# Altium project edison_breakout.PrjPcb (part 1 of 2)
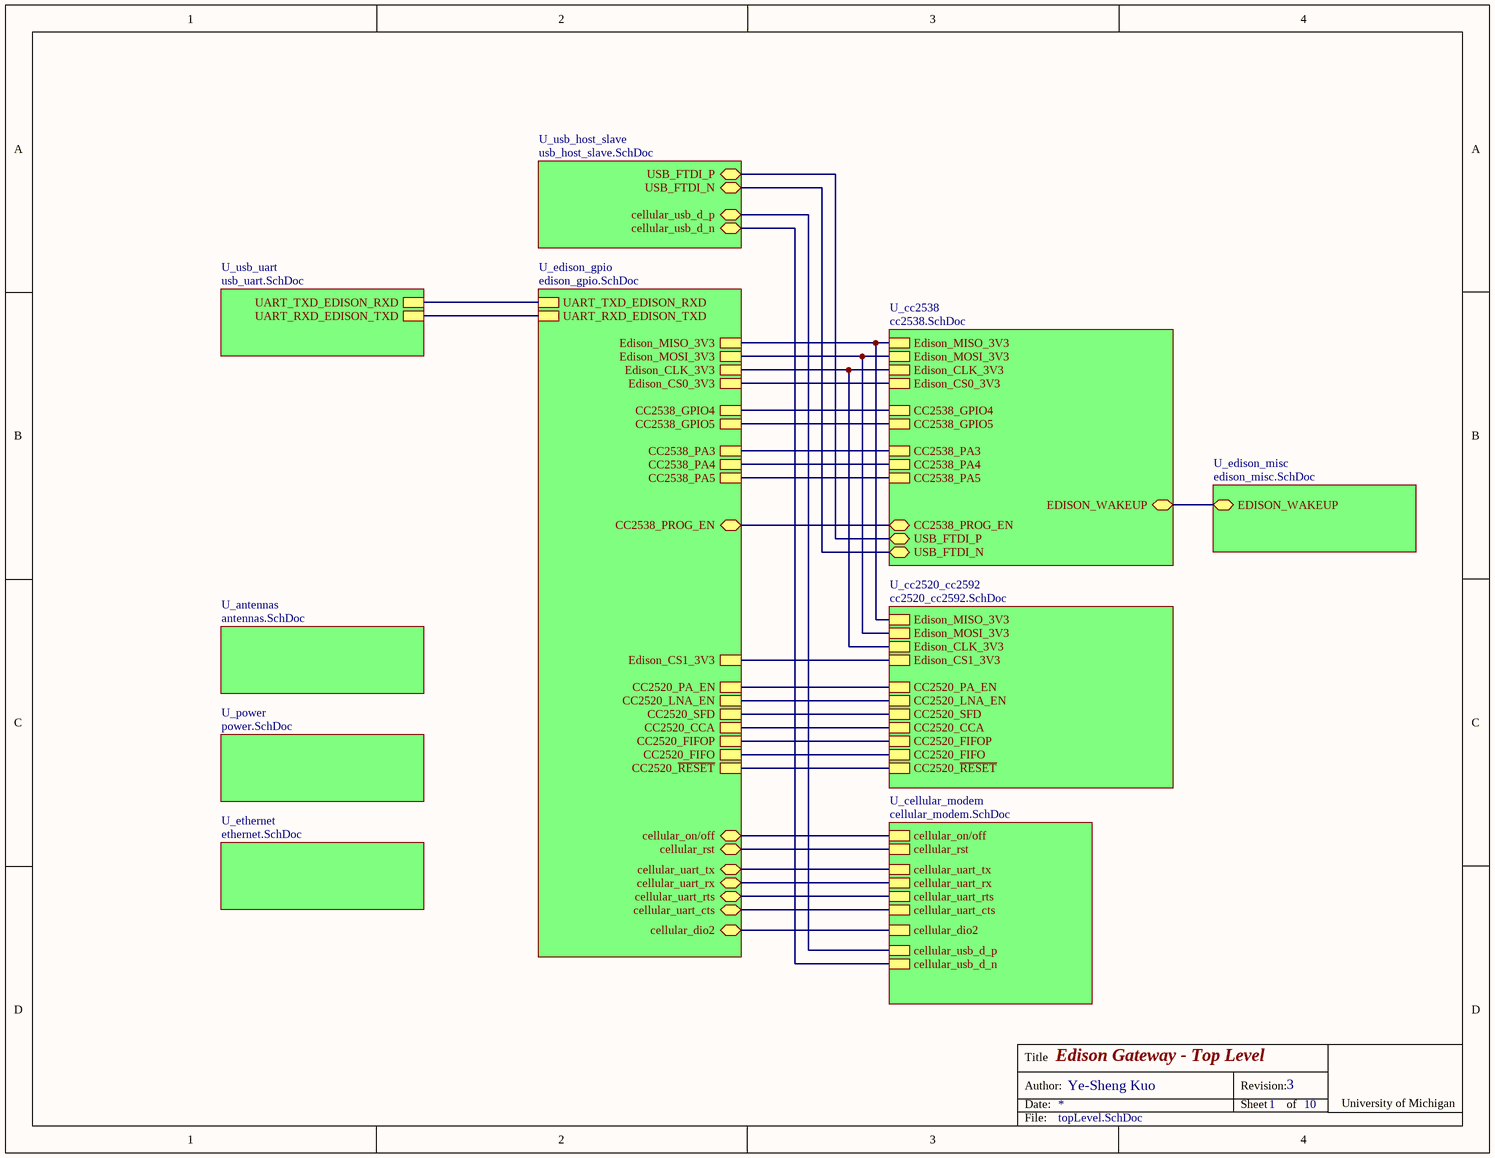
[diagram p0: topLevel.SchDoc]
11 sheets, 252 parts. Net scope: hierarchical (ports join the sheet entries above them; power ports are global).
Board files: edison_gateway_v3.PcbDoc, edison_gateway_v3_array.PcbDoc, edison_gateway_v3_array_stencil.PcbDoc
Sheets:
  topLevel.SchDoc
    U_cc2538 = cc2538.SchDoc
    U_edison_gpio = edison_gpio.SchDoc
    U_edison_misc = edison_misc.SchDoc
    U_ethernet = ethernet.SchDoc
    U_power = power.SchDoc
    U_usb_host_slave = usb_host_slave.SchDoc
    U_usb_uart = usb_uart.SchDoc
    U_cc2520_cc2592 = cc2520_cc2592.SchDoc
    U_cellular_modem = cellular_modem.SchDoc
    U_antennas = antennas.SchDoc

## Sheet topLevel.SchDoc: Edison Gateway - Top Level
size Letter; Author: Ye-Sheng Kuo; DocumentNumber: 1; Revision: 3; SheetNumber: 1; SheetTotal: 10

### Sub-sheets
U_antennas = antennas.SchDoc: no entries
U_cc2520_cc2592 = cc2520_cc2592.SchDoc: CC2520_PA_EN, CC2520_LNA_EN, CC2520_SFD, CC2520_CCA, CC2520_FIFOP, CC2520_FIFO, CC2520_~{RESET}, Edison_MISO_3V3, Edison_MOSI_3V3, Edison_CLK_3V3, Edison_CS1_3V3
U_cc2538 = cc2538.SchDoc: CC2538_PA3, CC2538_PA4, CC2538_PA5, Edison_MISO_3V3, Edison_MOSI_3V3, Edison_CLK_3V3, Edison_CS0_3V3, CC2538_GPIO4, CC2538_GPIO5, EDISON_WAKEUP, CC2538_PROG_EN, USB_FTDI_P, USB_FTDI_N
U_cellular_modem = cellular_modem.SchDoc: cellular_on/off, cellular_rst, cellular_usb_d_p, cellular_usb_d_n, cellular_uart_tx, cellular_uart_rx, cellular_uart_rts, cellular_uart_cts, cellular_dio2
U_edison_gpio = edison_gpio.SchDoc: UART_TXD_EDISON_RXD, UART_RXD_EDISON_TXD, Edison_MISO_3V3, Edison_MOSI_3V3, Edison_CLK_3V3, Edison_CS0_3V3, CC2538_GPIO4, CC2538_GPIO5, CC2538_PA3, CC2538_PA4, CC2538_PA5, Edison_CS1_3V3, CC2520_PA_EN, CC2520_LNA_EN, CC2520_SFD, CC2520_CCA, CC2520_FIFOP, CC2520_FIFO, CC2520_~{RESET}, CC2538_PROG_EN, cellular_on/off, cellular_uart_tx, cellular_uart_rx, cellular_uart_rts, cellular_rst, cellular_uart_cts, cellular_dio2
U_edison_misc = edison_misc.SchDoc: EDISON_WAKEUP
U_ethernet = ethernet.SchDoc: no entries
U_power = power.SchDoc: no entries
U_usb_host_slave = usb_host_slave.SchDoc: USB_FTDI_N, USB_FTDI_P, cellular_usb_d_p, cellular_usb_d_n
U_usb_uart = usb_uart.SchDoc: UART_TXD_EDISON_RXD, UART_RXD_EDISON_TXD

### Nets
CC2538_PA3: sheet U_cc2538/CC2538_PA3, sheet U_edison_gpio/CC2538_PA3
CC2538_PA4: sheet U_cc2538/CC2538_PA4, sheet U_edison_gpio/CC2538_PA4
CC2538_PA5: sheet U_cc2538/CC2538_PA5, sheet U_edison_gpio/CC2538_PA5
cellular_dio2: sheet U_edison_gpio/cellular_dio2, sheet U_cellular_modem/cellular_dio2
cellular_on/off: sheet U_edison_gpio/cellular_on/off, sheet U_cellular_modem/cellular_on/off
cellular_rst: sheet U_edison_gpio/cellular_rst, sheet U_cellular_modem/cellular_rst
cellular_usb_d_n: sheet U_usb_host_slave/cellular_usb_d_n, sheet U_cellular_modem/cellular_usb_d_n
cellular_usb_d_p: sheet U_usb_host_slave/cellular_usb_d_p, sheet U_cellular_modem/cellular_usb_d_p
Edison_CLK_3V3: sheet U_cc2538/Edison_CLK_3V3, sheet U_edison_gpio/Edison_CLK_3V3, sheet U_cc2520_cc2592/Edison_CLK_3V3
Edison_CS0_3V3: sheet U_cc2538/Edison_CS0_3V3, sheet U_edison_gpio/Edison_CS0_3V3
Edison_CS1_3V3: sheet U_edison_gpio/Edison_CS1_3V3, sheet U_cc2520_cc2592/Edison_CS1_3V3
Edison_GP14_3V3: sheet U_edison_gpio/CC2520_FIFOP, sheet U_cc2520_cc2592/CC2520_FIFOP
Edison_GP19_3V3: sheet U_edison_gpio/CC2520_~{RESET}, sheet U_cc2520_cc2592/CC2520_~{RESET}
Edison_GP20_3V3: sheet U_edison_gpio/CC2520_FIFO, sheet U_cc2520_cc2592/CC2520_FIFO
Edison_GP41_3V3: sheet U_cc2538/CC2538_GPIO5, sheet U_edison_gpio/CC2538_GPIO5
Edison_GP43_3V3: sheet U_cc2538/CC2538_GPIO4, sheet U_edison_gpio/CC2538_GPIO4
Edison_GP45: sheet U_cc2538/CC2538_PROG_EN, sheet U_edison_gpio/CC2538_PROG_EN
Edison_GP47_3V3: sheet U_edison_gpio/CC2520_LNA_EN, sheet U_cc2520_cc2592/CC2520_LNA_EN
Edison_GP48_3V3: sheet U_edison_gpio/CC2520_SFD, sheet U_cc2520_cc2592/CC2520_SFD
Edison_GP49_3V3: sheet U_edison_gpio/CC2520_CCA, sheet U_cc2520_cc2592/CC2520_CCA
Edison_GP183_3V3: sheet U_edison_gpio/CC2520_PA_EN, sheet U_cc2520_cc2592/CC2520_PA_EN
Edison_MISO_3V3: sheet U_cc2538/Edison_MISO_3V3, sheet U_edison_gpio/Edison_MISO_3V3, sheet U_cc2520_cc2592/Edison_MISO_3V3
Edison_MOSI_3V3: sheet U_cc2538/Edison_MOSI_3V3, sheet U_edison_gpio/Edison_MOSI_3V3, sheet U_cc2520_cc2592/Edison_MOSI_3V3
Edison_Serial_RX: sheet U_edison_gpio/UART_TXD_EDISON_RXD, sheet U_usb_uart/UART_TXD_EDISON_RXD
Edison_Serial_TX: sheet U_edison_gpio/UART_RXD_EDISON_TXD, sheet U_usb_uart/UART_RXD_EDISON_TXD
Edison_UART_CTS: sheet U_edison_gpio/cellular_uart_cts, sheet U_cellular_modem/cellular_uart_cts
Edison_UART_RTS: sheet U_edison_gpio/cellular_uart_rts, sheet U_cellular_modem/cellular_uart_rts
Edison_UART_RX: sheet U_edison_gpio/cellular_uart_tx, sheet U_cellular_modem/cellular_uart_tx
Edison_UART_TX: sheet U_edison_gpio/cellular_uart_rx, sheet U_cellular_modem/cellular_uart_rx
USB_FTDI_N: sheet U_cc2538/USB_FTDI_N, sheet U_usb_host_slave/USB_FTDI_N
USB_FTDI_P: sheet U_cc2538/USB_FTDI_P, sheet U_usb_host_slave/USB_FTDI_P
NetR36_1: sheet U_cc2538/EDISON_WAKEUP, sheet U_edison_misc/EDISON_WAKEUP

### Notes on the sheet
- Title
- Date:
- Author:
- Revision:
- Sheet
- of
- University of Michigan
- File:

## Sheet cc2538.SchDoc: Edison Gateway - CC2538
size Letter; Author: Ye-Sheng Kuo; DocumentNumber: 8; Revision: 3; SheetNumber: 8; SheetTotal: 10
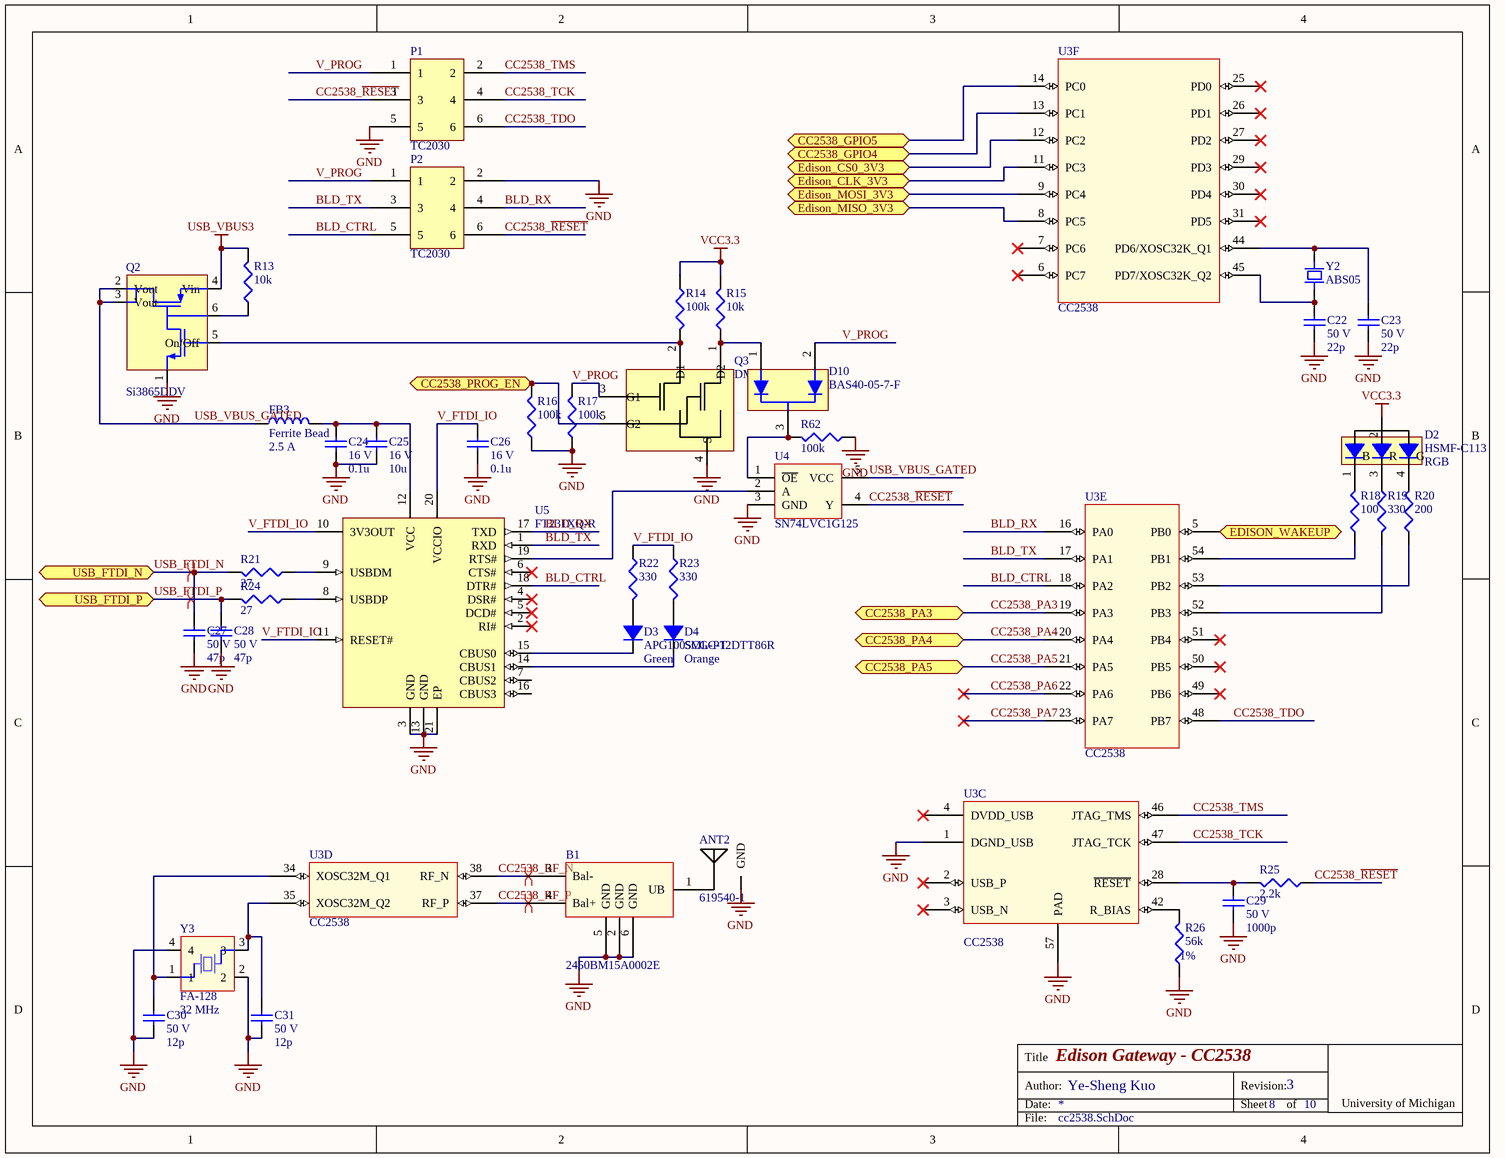
[diagram p1: cc2538.SchDoc]

### Parts
ANT2  619540-1  [619540-1]
B1  2450BM15A0002E  [2450BM15A0002]
C22  voltage rated: 50 V  [0402]  (hidden comment: 22p)
C23  voltage rated: 50 V  [0402]  (hidden comment: 22p)
C24  voltage rated: 16 V  [0402]  (hidden comment: 0.1u)
C25  voltage rated: 16 V  [0603]  (hidden comment: 10u)
C26  voltage rated: 16 V  [0402]  (hidden comment: 0.1u)
C27  voltage rated: 50 V  [0402]  (hidden comment: 47p)
C28  voltage rated: 50 V  [0402]  (hidden comment: 47p)
C29  voltage rated: 50 V  [0402]  (hidden comment: 1000p)
C30  voltage rated: 50 V  [0402]  (hidden comment: 12p)
C31  voltage rated: 50 V  [0402]  (hidden comment: 12p)
D2  HSMF-C113  value RGB  [HSMF]
D3  APG1005CGC-T  value Green  [0402 - LED]
D4  SML-P12DTT86R  value Orange  [0402 - LED]
D10  BAS40-05-7-F  [SOT23-3]
FB3  Ferrite Bead  Current Rating (Max): 2.5 A  [0603]
P1  TC2030  [TC2030-IDC-NLFP]
P2  TC2030  [TC2030-IDC-NLFP]
Q2  Si3865DDV  [TSOT-23]
Q3  DMN32D2LDF  [SOT-353-5]
R13  10k  [0402]
R14  100k  [0402]
R15  10k  [0402]
R16  100k  [0402]
R17  100k  [0402]
R18  100  [0402]
R19  330  [0402]
R20  200  [0402]
R21  27  [0402]
R22  330  [0402]
R23  330  [0402]
R24  27  [0402]
R25  2.2k  [0402]
R26  Tolerance: 1%  [0402]  (hidden comment: 56k)
R62  100k  [0402]
U3  CC2538  [QFN56]  (parts C,D,E,F of 6)
U4  SN74LVC1G125  [SOT23-5]
U5  FT231XQ-R  [QFN-20_N]
Y2  ABS05  [ABS05]
Y3  FA-128  frequency: 32 MHz  [FA-128]

### Ports
CC2538_GPIO4, CC2538_GPIO5, CC2538_PA3, CC2538_PA4, CC2538_PA5, CC2538_PROG_EN, Edison_CLK_3V3, Edison_CS0_3V3, Edison_MISO_3V3, Edison_MOSI_3V3, EDISON_WAKEUP, USB_FTDI_N, USB_FTDI_P

### Nets
GND: ANT2.1(GND) B1.2(GND) B1.5(GND) B1.6(GND) C22.2 C23.2 C24.2 C25.2 C26.2 C27.1 C28.1 C29.2 C30.1 C31.1 P1.5 P2.2 Q2.1 Q3.4(S) R16.2 R17.2 R26.2 R62.2 U3.1(DGND_USB) U3.57(PAD) U4.3(GND) U5.3(GND) U5.13(GND) U5.21(EP) Y3.2 Y3.4
USB_VBUS3: Q2.4(Vin) R13.1
VCC3.3: D2.2 R14.1 R15.1
BLD_CTRL: P2.5 U3.18(PA2) U5.18(DTR#)
BLD_RX: P2.4 U3.16(PA0) U5.17(TXD)
BLD_TX: P2.3 U3.17(PA1) U5.1(RXD)
CC2538_PA3: U3.19(PA3) ; port CC2538_PA3
CC2538_PA4: U3.20(PA4) ; port CC2538_PA4
CC2538_PA5: U3.21(PA5) ; port CC2538_PA5
CC2538_PA6: U3.22(PA6)
CC2538_PA7: U3.23(PA7)
CC2538_~{RESET}: P1.3 P2.6 R25.2 U4.4(Y)
CC2538_RF_N: B1.3(Bal-) U3.38(RF_N)
CC2538_RF_P: B1.4(Bal+) U3.37(RF_P)
CC2538_TCK: P1.4 U3.47(JTAG_TCK)
CC2538_TDO: P1.6 U3.48(PB7)
CC2538_TMS: P1.2 U3.46(JTAG_TMS)
Edison_CLK_3V3: U3.11(PC3) ; port Edison_CLK_3V3
Edison_CS0_3V3: U3.12(PC2) ; port Edison_CS0_3V3
Edison_GP41_3V3: U3.14(PC0) ; port CC2538_GPIO5
Edison_GP43_3V3: U3.13(PC1) ; port CC2538_GPIO4
Edison_GP45: Q3.5(G2) R16.1 ; port CC2538_PROG_EN
Edison_MISO_3V3: U3.8(PC5) ; port Edison_MISO_3V3
Edison_MOSI_3V3: U3.9(PC4) ; port Edison_MOSI_3V3
USB_FTDI_N: C27.2 R21.1 ; port USB_FTDI_N
USB_FTDI_P: C28.2 R24.1 ; port USB_FTDI_P
USB_VBUS_GATED: FB3.2 Q2.2(Vout) Q2.3(Vout) U4.5(VCC)
V_FTDI_IO: C26.1 R22.2 R23.2 U5.10(3V3OUT) U5.11(RESET#) U5.20(VCCIO)
V_PROG: D10.2 P1.1 P2.1 Q3.3(G1) R17.1
NetANT2_2: ANT2.2 B1.1(UB)
NetC22_1: C22.1 U3.45(PD7/XOSC32K_Q2) Y2.2
NetC23_1: C23.1 U3.44(PD6/XOSC32K_Q1) Y2.1
NetC24_1: C24.1 C25.1 FB3.1 U5.12(VCC)
NetC29_1: C29.1 R25.1 U3.28(~{RESET})
NetC30_2: C30.2 U3.34(XOSC32M_Q1) Y3.1
NetC31_2: C31.2 U3.35(XOSC32M_Q2) Y3.3
NetD2_1: D2.1 R18.1
NetD2_3: D2.3 R19.2
NetD2_4: D2.4 R20.1
NetD3_1: D3.1 R22.1
NetD3_2: D3.2 U5.15(CBUS0)
NetD4_1: D4.1 R23.1
NetD4_2: D4.2 U5.14(CBUS1)
NetD10_1: D10.1 Q3.1(D2) R15.2
NetD10_3: D10.3 R62.1 U4.1(~{OE})
NetQ2_5: Q2.5(On/Off) Q3.2(D1) R14.2
NetQ2_6: Q2.6 R13.2
NetR18_2: R18.2 U3.54(PB1)
NetR19_1: R19.1 U3.52(PB3)
NetR20_2: R20.2 U3.53(PB2)
NetR21_2: R21.2 U5.9(USBDM)
NetR24_2: R24.2 U5.8(USBDP)
NetR26_1: R26.1 U3.42(R_BIAS)
NetR36_1: U3.5(PB0) ; port EDISON_WAKEUP
NetU4_2: U4.2(A) U5.19(RTS#)

Not connected (* = marked no-connect by the designer): U3 2(USB_P)* 3(USB_N)* 4(DVDD_USB)* 6(PC7)* 7(PC6)* 25(PD0)* 26(PD1)* 27(PD2)* 29(PD3)* 30(PD4)* 31(PD5)* 49(PB6)* 50(PB5)* 51(PB4)*; U5 2(RI#)* 4(DSR#)* 5(DCD#)* 6(CTS#)* 7(CBUS2) 16(CBUS3)

### Layout directives
differential pair: CC2538_RF_N, CC2538_RF_P, USB_FTDI_N, USB_FTDI_P

### Notes on the sheet
- Title
- Date:
- Author:
- Revision:
- Sheet
- of
- University of Michigan
- File:
- (in symbol HSMF-C113) B; R; G

### Library data of the parts
ANT2 = 619540-1: CONN SMA JACK; Supplier 1: Digi-Key; Supplier Part Number 1: A120734-ND
B1 = 2450BM15A0002E: 2.45 GHz Balun for TI CC253X; Supplier 1: Digi-Key; Supplier Part Number 1: 712-1536-1-ND
C22 C23 = 500R07S220GV4T: 22pF ±2% 50V Ceramic Capacitor C0G, NP0 0402; Manufacture: Johanson Technology Inc.; Note: RF application; tolerance: 2%; package: 0402; Supplier 1: Digi-Key; Supplier Part Number 1: 712-1274-1-ND; Value: 22p; Temperature Coefficient: C0G, NP0; Manufacturer Part Number: 500R07S220GV4T
C24 C26 = GRM155R71C104KA88D: 0.10µF ±10% 16V Ceramic Capacitor X7R 0402; Manufacture: Murata; tolerance: 10%; package: 0402; Supplier 1: Digi-Key; Supplier Part Number 1: 490-3261-1-ND; Value: 0.1u; Temperature Coefficient: X7R; Manufacturer Part Number: GRM155R71C104KA88D
C25 = GRM188C81C106MA73D: 10µF ±20% 16V Ceramic Capacitor X6S 0603; Manufacture: Murata; tolerance: 20%; package: 0603; Temperature Coefficient: X6S; Supplier 1: Digi-Key; Supplier Part Number 1: 490-7198-1-ND; Value: 10u; Manufacturer Part Number: GRM188C81C106MA73D
C27 C28 = 500R07N470JV4T: 47pF ±5% 50V Ceramic Capacitor C0G, NP0 0402; Manufacture: Johanson Dielectrics Inc.; tolerance: 5%; package: 0402; Supplier 1: Digi-Key; Supplier Part Number 1: 709-1121-1-ND; Value: 47p; Temperature Coefficient: C0G, NP0; Manufacturer Part Number: 500R07N470JV4T
C29 = C1005C0G1H102J050BA: 1000pF ±5% 50V Ceramic Capacitor C0G, NP0 0402; Manufacture: TDK; tolerance: 5%; package: 0402; Supplier 1: Digi-Key; Supplier Part Number 1: 445-6846-1-ND; Value: 1000p; Temperature Coefficient: C0G, NP0; Manufacturer Part Number: C1005C0G1H102J050BA
C30 C31 = 500R07S120GV4T: 12pF ±2% 50V Ceramic Capacitor C0G, NP0 0402; Manufacture: Johanson Technology Inc.; Note: RF application; tolerance: 2%; package: 0402; Supplier 1: Digi-Key; Supplier Part Number 1: 712-1256-1-ND; Value: 12p; Temperature Coefficient: C0G, NP0; Manufacturer Part Number: 500R07S120GV4T
D2 = HSMF-C113: Red, Green, Blue (RGB) 626nm Red, 572nm Green, 470nm Blue LED Indication - Discrete 1.9V Red, 2V Green, 3.4V Blue 4-SMD; Manufacturer: Broadcom Limited; Supplier 1: Digi-Key; Supplier Part Number 1: 516-2232-1-ND; Manufacturer Part Number: HSMF-C113; Wavelength: 626nm Red, 572nm Green, 470nm Blue
D3 = APG1005CGC-T: Green 571nm LED Indication - Discrete 2V 0402 (1005 Metric); Manufacturer: Kingbright; Current @ VF: 20 mA; package: 0402; Forward Voltage: 2 V; Manufacturer Part Number: APG1005CGC-T; Wavelength: 571 nm; Supplier 1: Digi-Key; Supplier Part Number 1: 754-1811-1-ND
D4 = SML-P12DTT86R: Orange 605nm LED Indication - Discrete 2.1V 0402; Manufacturer: Rohm Semiconductor; Current @ VF: 20 mA; Supplier 1: Digi-Key; Supplier Part Number 1: 846-1200-1-ND; package: 0402; Forward Voltage: 2.1 V; Manufacturer Part Number: SML-P12DTT86R; Wavelength: 605 nm
D10 = BAS40-05-7-F: Diode Array 1Pair Common Cathode Schottky 40V 200mA (DC) Surface Mount TO-236-3, SC-59, SOT-23-3; Manufacturer: Diodes Incorporated; Forward Voltage @ If: 1 V @ 40 mA; Manufacturer Part Number: BAS40-05-7-F; current: 200 mA; reverse voltage: 40 V; diode type: Schottky; Supplier 1: Digi-Key; Supplier Part Number 1: BAS40-05FDICT-ND
FB3 = BLM18SG221TN1D: FERRITE BEAD 220 OHM 0603; Manufacturer: Murata; DC resistance: 40m; Impedance @ Frequency: 220 Ohm @ 100MHz; package: 0603; Supplier 1: Digi-Key; Supplier Part Number 1: 490-5225-1-ND; Manufacturer Part Number: BLM18SG221TN1D
P1 P2 = TC2030: TC2030-MCP-NL; Note: Not a part
Q2 = Si3865DDV: Load Switch; Supplier 1: Digi-Key; Supplier Part Number 1: SI3865DDV-T1-GE3CT-ND
Q3 = DMN32D2LDF: Common Source Dual N-Channel MOSFET; Supplier 1: Digi-Key; Supplier Part Number 1: DMN32D2LDF-7DICT-ND
R13 R15 = CRCW040210K0FKED: RES SMD 10K OHM 1% 1/16W 0402; Manufacturer: Vishay Dale; Temperature Coefficient: 100 ppm/C; Tolerance: 1%; Power: 1/16 W; package: 0402; Supplier 1: Digi-Key; Supplier Part Number 1: 541-10.0KLCT-ND; value: 10k; Manufacturer Part Number: CRCW040210K0FKED
R14 R16 R17 R62 = CRCW0402100KFKED: RES SMD 100K OHM 1% 1/16W 0402; Manufacturer: Vishay Dale; Temperature Coefficient: 100 ppm/C; Tolerance: 1%; Power: 1/16 W; Supplier 1: Digi-Key; Supplier Part Number 1: 541-100KLCT-ND; package: 0402; value: 100k; Manufacturer Part Number: CRCW0402100KFKED
R18 = CRCW0402100RFKED: RES SMD 100 OHM 1% 1/16W 0402; Manufacturer: Vishay Dale; Temperature Coefficient: 100 ppm/C; Tolerance: 1%; Power: 1/16 W; package: 0402; Supplier 1: Digi-Key; Supplier Part Number 1: 541-100LCT-ND; value: 100; Manufacturer Part Number: CRCW0402100RFKED
R19 R22 R23 = CRCW0402330RFKED: RES SMD 330 OHM 1% 1/16W 0402; Manufacturer: Vishay Dale; Temperature Coefficient: 100 ppm/C; Tolerance: 1%; Power: 1/16 W; package: 0402; Supplier 1: Digi-Key; Supplier Part Number 1: 541-330LCT-ND; value: 330; Manufacturer Part Number: CRCW0402330RFKED
R20 = CRCW0402200RFKED: RES SMD 200 OHM 1% 1/16W 0402; Manufacturer: Vishay Dale; Temperature Coefficient: 100 ppm/C; Tolerance: 1%; Power: 1/16 W; package: 0402; Supplier 1: Digi-Key; Supplier Part Number 1: 541-200LCT-ND; value: 200; Manufacturer Part Number: CRCW0402200RFKED
R21 R24 = CRCW040227R0FKED: RES SMD 27 OHM 1% 1/16W 0402; Manufacturer: Vishay Dale; Temperature Coefficient: 100 ppm/C; Tolerance: 1%; Power: 1/16 W; package: 0402; Supplier 1: Digi-Key; Supplier Part Number 1: 541-27.0LCT-ND; value: 27; Manufacturer Part Number: CRCW040227R0FKED
R25 = CRCW04022K20FKED: RES SMD 2.2K OHM 1% 1/16W 0402; Manufacturer: Vishay Dale; Temperature Coefficient: 100 ppm/C; Tolerance: 1%; Power: 1/16 W; package: 0402; Supplier 1: Digi-Key; Supplier Part Number 1: 541-2.20KLCT-ND; value: 2.2k; Manufacturer Part Number: CRCW04022K20FKED
R26 = CRCW040256K0FKED: RES SMD 56K OHM 1% 1/16W 0402; Manufacturer: Vishay Dale; Temperature Coefficient: 100 ppm/C; Power: 1/16 W; package: 0402; Supplier 1: Digi-Key; Supplier Part Number 1: 541-56.0KLCT-ND; value: 56k; Manufacturer Part Number: CRCW040256K0FKED
U3 = CC2538: A Powerful System-On-Chip for 2.4-GHz IEEE 802.15.4, 6LoWPAN  and ZigBee Applications; Supplier 1: Digi-Key; Supplier Part Number 1: 296-35797-1-ND
U4 = SN74LVC1G125: Single Bus Buffer Gate With 3-State Output; Supplier 1: Digi-Key; Supplier Part Number 1: 296-11603-1-ND
U5 = FT231XQ-R: USB to Full-Handshake UART Interface Chip, UHCI/OHCI/EHCI Compatible, USB 2.0 Compatible, -40 to +85 degC, 20-Pin QFN, Pb-Free, Tape and Reel; Manufacturer: FTDI; DatasheetVersion: ver 1.2, Feb-2013; PackageVersion: Feb-13; PackageReference: QFN-20; PackageDescription: 20-Pin Quad Flat No-Lead, 4 x 4 mm Body, 0.5 mm Pitch; Code_JEDEC: MO-220WGGD-1; PartNumber: FT231XQ-R; ComponentLink1Description: Manufacturer URL; ComponentLink1URL: http://www.ftdichip.com/; ComponentLink2Description: Datasheet; ComponentLink2URL: http://www.ftdichip.com/Support/Documents/DataSheets/ICs/DS_FT231X.pdf; ComponentLink3Description: FT231X Product Page; ComponentLink3URL: www.ftdichip.com/Products/ICs/FT231X.html; Supplier 1: Digi-Key; Supplier Part Number 1: 768-1155-ND
Y2 = ABS05: 32768 Hz SMD Low profile crystal; Supplier 1: Digi-Key; Supplier Part Number 1: 535-11899-1-ND
Y3 = FA-128: MHz Range Crystal Unit; Load capatance: 10 pF; ESR: 60; stability: 20 ppm; Supplier 1: Digi-Key; Supplier Part Number 1: SER4079CT-ND

## Sheet edison_gpio.SchDoc: Edison Gateway - GPIO
size Letter; Author: Ye-Sheng Kuo; DocumentNumber: 3; Revision: 3; SheetNumber: 3; SheetTotal: 10
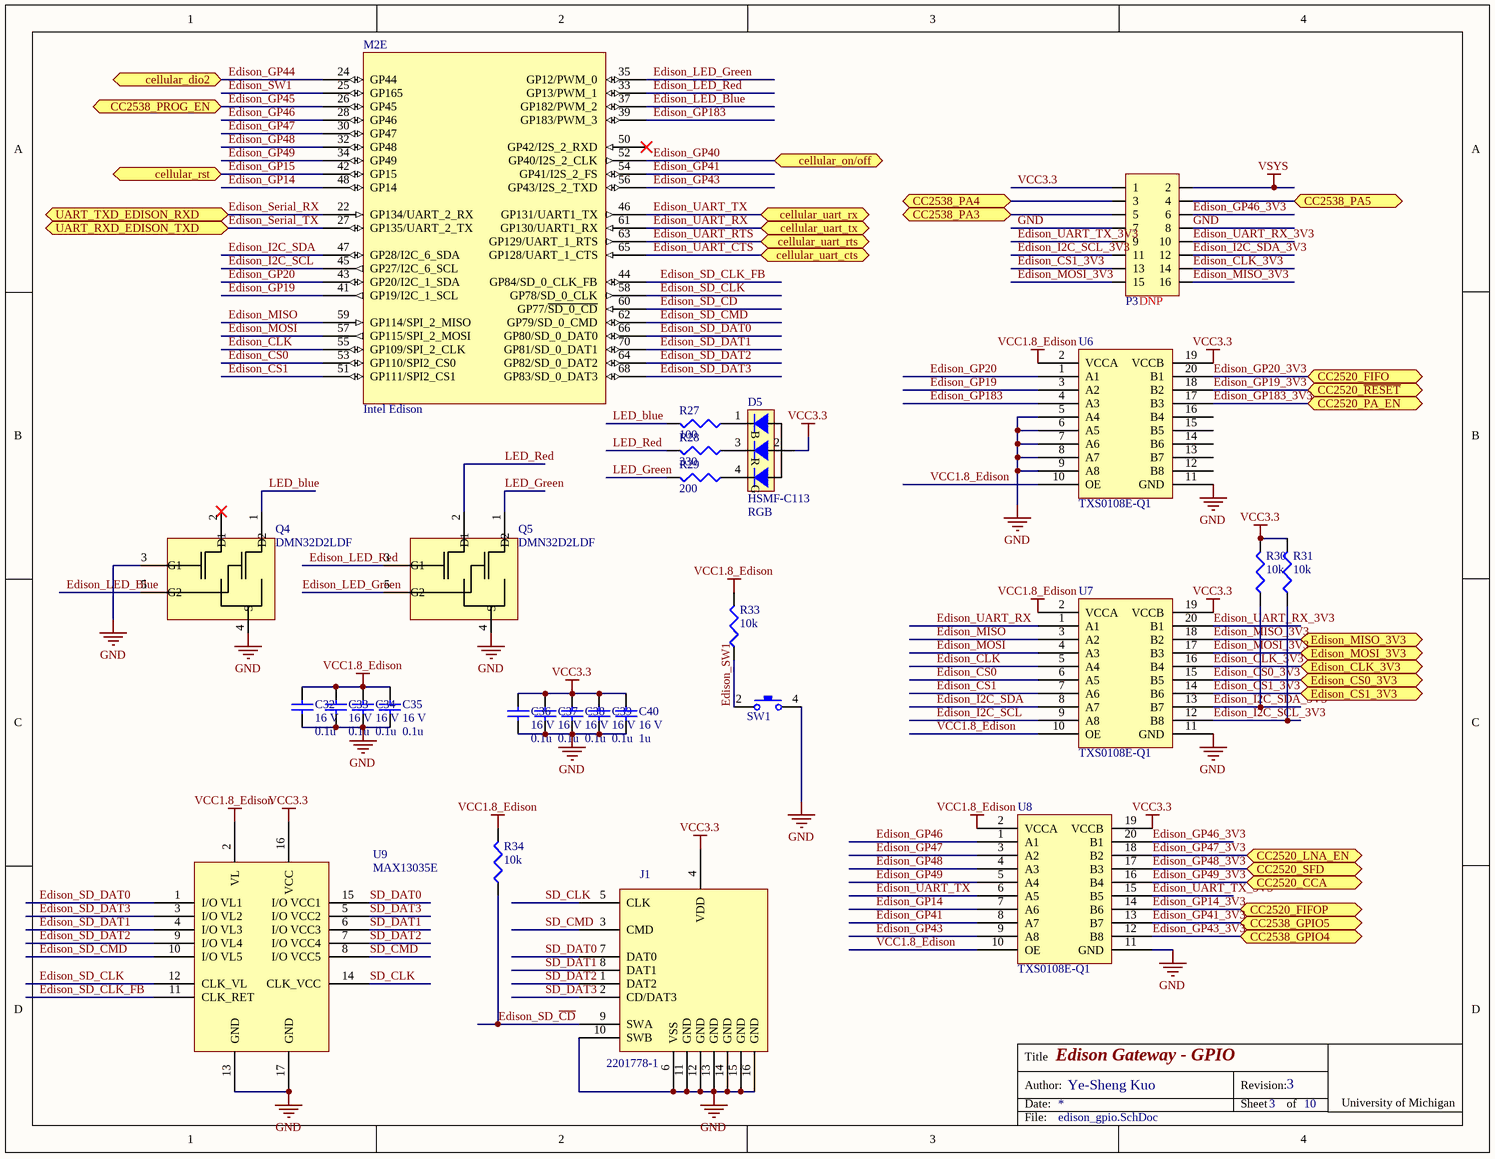
[diagram p2: edison_gpio.SchDoc]

### Parts
C32  voltage rated: 16 V  [0402]  (hidden comment: 0.1u)
C33  voltage rated: 16 V  [0402]  (hidden comment: 0.1u)
C34  voltage rated: 16 V  [0402]  (hidden comment: 0.1u)
C35  voltage rated: 16 V  [0402]  (hidden comment: 0.1u)
C36  voltage rated: 16 V  [0402]  (hidden comment: 0.1u)
C37  voltage rated: 16 V  [0402]  (hidden comment: 0.1u)
C38  voltage rated: 16 V  [0402]  (hidden comment: 0.1u)
C39  voltage rated: 16 V  [0402]  (hidden comment: 0.1u)
C40  voltage rated: 16 V  [0402]  (hidden comment: 1u)
D5  HSMF-C113  value RGB  [HSMF]
J1  2201778-1  [2201778-1]
M2  Intel Edison  [Intel Edison mating]  (part E of 5)
P3  Note: DNP  [2x8 header]  (hidden comment: 2 x 8 header)
Q4  DMN32D2LDF  [SOT-353-5]
Q5  DMN32D2LDF  [SOT-353-5]
R27  100  [0402]
R28  330  [0402]
R29  200  [0402]
R30  10k  [0402]
R31  10k  [0402]
R33  10k  [0402]
R34  10k  [0402]
SW1  KT11P4SA2M35LFG  [KT11PXSA2M]  (value not drawn)
U6  TXS0108E-Q1  [TSSOP-20]
U7  TXS0108E-Q1  [TSSOP-20]
U8  TXS0108E-Q1  [TSSOP-20]
U9  MAX13035E  [TQFN-16]

### Ports
CC2520_CCA, CC2520_FIFO, CC2520_FIFOP, CC2520_LNA_EN, CC2520_PA_EN, CC2520_SFD, CC2520_~{RESET}, CC2538_GPIO4, CC2538_GPIO5, CC2538_PA3, CC2538_PA4, CC2538_PA5, CC2538_PROG_EN, cellular_dio2, cellular_on/off, cellular_rst, cellular_uart_cts, cellular_uart_rts, cellular_uart_rx, cellular_uart_tx, Edison_CLK_3V3, Edison_CS0_3V3, Edison_CS1_3V3, Edison_MISO_3V3, Edison_MOSI_3V3, UART_RXD_EDISON_TXD, UART_TXD_EDISON_RXD

### Nets
GND: C32.2 C33.2 C34.2 C35.2 C36.2 C37.2 C38.2 C39.2 C40.2 J1.6(VSS) J1.10(SWB) J1.11(GND) J1.12(GND) J1.13(GND) J1.14(GND) J1.15(GND) J1.16(GND) P3.7 P3.8 Q4.3(G1) Q4.4(S) Q5.4(S) SW1.4 U6.5(A4) U6.6(A5) U6.7(A6) U6.8(A7) U6.9(A8) U6.11(GND) U7.11(GND) U8.11(GND) U9.13(GND) U9.17(GND)
VCC1.8_Edison: C32.1 C33.1 C34.1 C35.1 R33.1 R34.1 U6.2(VCCA) U6.10(OE) U7.2(VCCA) U7.10(OE) U8.2(VCCA) U8.10(OE) U9.2(VL)
VCC3.3: C36.1 C37.1 C38.1 C39.1 C40.1 D5.2 J1.4(VDD) P3.1 R30.1 R31.1 U6.19(VCCB) U7.19(VCCB) U8.19(VCCB) U9.16(VCC)
VSYS: P3.2
CC2538_PA3: P3.5 ; port CC2538_PA3
CC2538_PA4: P3.3 ; port CC2538_PA4
CC2538_PA5: P3.4 ; port CC2538_PA5
Edison_CLK: M2.55(GP109/SPI_2_CLK) U7.5(A4)
Edison_CLK_3V3: P3.14 U7.16(B4) ; port Edison_CLK_3V3
Edison_CS0: M2.53(GP110/SPI2_CS0) U7.6(A5)
Edison_CS0_3V3: U7.15(B5) ; port Edison_CS0_3V3
Edison_CS1: M2.51(GP111/SPI2_CS1) U7.7(A6)
Edison_CS1_3V3: P3.13 U7.14(B6) ; port Edison_CS1_3V3
Edison_GP14: M2.48(GP14) U8.7(A6)
Edison_GP14_3V3: U8.14(B6) ; port CC2520_FIFOP
Edison_GP15: M2.42(GP15) ; port cellular_rst  [project net cellular_rst]
Edison_GP19: M2.41(GP19/I2C_1_SCL) U6.3(A2)
Edison_GP19_3V3: U6.18(B2) ; port CC2520_~{RESET}
Edison_GP20: M2.43(GP20/I2C_1_SDA) U6.1(A1)
Edison_GP20_3V3: U6.20(B1) ; port CC2520_FIFO
Edison_GP40: M2.52(GP40/I2S_2_CLK) ; port cellular_on/off  [project net cellular_on/off]
Edison_GP41: M2.54(GP41/I2S_2_FS) U8.8(A7)
Edison_GP41_3V3: U8.13(B7) ; port CC2538_GPIO5
Edison_GP43: M2.56(GP43/I2S_2_TXD) U8.9(A8)
Edison_GP43_3V3: U8.12(B8) ; port CC2538_GPIO4
Edison_GP44: M2.24(GP44) ; port cellular_dio2  [project net cellular_dio2]
Edison_GP45: M2.26(GP45) ; port CC2538_PROG_EN
Edison_GP46: M2.28(GP46) U8.1(A1)
Edison_GP46_3V3: P3.6 U8.20(B1)
Edison_GP47: M2.30(GP47) U8.3(A2)
Edison_GP47_3V3: U8.18(B2) ; port CC2520_LNA_EN
Edison_GP48: M2.32(GP48) U8.4(A3)
Edison_GP48_3V3: U8.17(B3) ; port CC2520_SFD
Edison_GP49: M2.34(GP49) U8.5(A4)
Edison_GP49_3V3: U8.16(B4) ; port CC2520_CCA
Edison_GP183: M2.39(GP183/PWM_3) U6.4(A3)
Edison_GP183_3V3: U6.17(B3) ; port CC2520_PA_EN
Edison_I2C_SCL: M2.45(GP27/I2C_6_SCL) U7.9(A8)
Edison_I2C_SCL_3V3: P3.11 R31.2 U7.12(B8)
Edison_I2C_SDA: M2.47(GP28/I2C_6_SDA) U7.8(A7)
Edison_I2C_SDA_3V3: P3.12 R30.2 U7.13(B7)
Edison_LED_Blue: M2.37(GP182/PWM_2) Q4.5(G2)
Edison_LED_Green: M2.35(GP12/PWM_0) Q5.5(G2)
Edison_LED_Red: M2.33(GP13/PWM_1) Q5.3(G1)
Edison_MISO: M2.59(GP114/SPI_2_MISO) U7.3(A2)
Edison_MISO_3V3: P3.16 U7.18(B2) ; port Edison_MISO_3V3
Edison_MOSI: M2.57(GP115/SPI_2_MOSI) U7.4(A3)
Edison_MOSI_3V3: P3.15 U7.17(B3) ; port Edison_MOSI_3V3
Edison_SD_~{CD}: J1.9(SWA) M2.60(GP77/~{SD_0_CD}) R34.2
Edison_SD_CLK: M2.58(GP78/SD_0_CLK) U9.12(CLK_VL)
Edison_SD_CLK_FB: M2.44(GP84/SD_0_CLK_FB) U9.11(CLK_RET)
Edison_SD_CMD: M2.62(GP79/SD_0_CMD) U9.10(I/O_VL5)
Edison_SD_DAT0: M2.66(GP80/SD_0_DAT0) U9.1(I/O_VL1)
Edison_SD_DAT1: M2.70(GP81/SD_0_DAT1) U9.4(I/O_VL3)
Edison_SD_DAT2: M2.64(GP82/SD_0_DAT2) U9.9(I/O_VL4)
Edison_SD_DAT3: M2.68(GP83/SD_0_DAT3) U9.3(I/O_VL2)
Edison_Serial_RX: M2.22(GP134/UART_2_RX) ; port UART_TXD_EDISON_RXD
Edison_Serial_TX: M2.27(GP135/UART_2_TX) ; port UART_RXD_EDISON_TXD
Edison_SW1: M2.25(GP165) R33.2 SW1.2
Edison_UART_CTS: M2.65(GP128/UART_1_CTS) ; port cellular_uart_cts
Edison_UART_RTS: M2.63(GP129/UART_1_RTS) ; port cellular_uart_rts
Edison_UART_RX: M2.61(GP130/UART1_RX) U7.1(A1) ; port cellular_uart_tx
Edison_UART_RX_3V3: P3.10 U7.20(B1)
Edison_UART_TX: M2.46(GP131/UART1_TX) U8.6(A5) ; port cellular_uart_rx
Edison_UART_TX_3V3: P3.9 U8.15(B5)
LED_blue: Q4.1(D2) R27.1
LED_Green: Q5.1(D2) R29.1
LED_Red: Q5.2(D1) R28.1
SD_CLK: J1.5(CLK) U9.14(CLK_VCC)
SD_CMD: J1.3(CMD) U9.8(I/O_VCC5)
SD_DAT0: J1.7(DAT0) U9.15(I/O_VCC1)
SD_DAT1: J1.8(DAT1) U9.6(I/O_VCC3)
SD_DAT2: J1.1(DAT2) U9.7(I/O_VCC4)
SD_DAT3: J1.2(CD/DAT3) U9.5(I/O_VCC2)
NetD5_1: D5.1 R27.2
NetD5_3: D5.3 R28.2
NetD5_4: D5.4 R29.2

Not connected (* = marked no-connect by the designer): M2 50(GP42/I2S_2_RXD)*; Q4 2(D1)*; U6 12(B8) 13(B7) 14(B6) 15(B5) 16(B4)

### Notes on the sheet
- Title
- Date:
- Author:
- Revision:
- Sheet
- of
- University of Michigan
- File:
- (in symbol HSMF-C113) B; R; G

### Library data of the parts
C32-C39 = GRM155R71C104KA88D: as C24 on sheet cc2538; tolerance: 10%; package: 0402; Supplier 1: Digi-Key; Supplier Part Number 1: 490-3261-1-ND; Value: 0.1u; Temperature Coefficient: X7R; Manufacturer Part Number: GRM155R71C104KA88D
C40 = C1005X6S1C105K050BC: 1µF ±10% 16V Ceramic Capacitor X6S 0402; Manufacture: TDK; tolerance: 10%; package: 0402; Supplier 1: Digi-Key; Supplier Part Number 1: 445-9086-1-ND; Value: 1u; Temperature Coefficient: X6S; Manufacturer Part Number: C1005X6S1C105K050BC
D5 = HSMF-C113: as D2 on sheet cc2538; Supplier 1: Digi-Key; Supplier Part Number 1: 516-2232-1-ND; Manufacturer Part Number: HSMF-C113; Wavelength: 626nm Red, 572nm Green, 470nm Blue
J1 = 2201778-1: Micro SD Slot; Supplier 1: Digi-Key; Supplier Part Number 1: A118117CT-ND
M2 = Intel Edison: Note: Mating connector: H124603CT-ND
P3 = 2 x 8 header: 100 mils standard header; Supplier 1: Digi-Key; Supplier Part Number 1: 609-3220-ND
Q4 Q5 = DMN32D2LDF: Common Source Dual N-Channel MOSFET; Supplier 1: Digi-Key; Supplier Part Number 1: DMN32D2LDF-7DICT-ND
R27 = CRCW0402100RFKED: as R18 on sheet cc2538; Tolerance: 1%; Power: 1/16 W; package: 0402; Supplier 1: Digi-Key; Supplier Part Number 1: 541-100LCT-ND; value: 100; Manufacturer Part Number: CRCW0402100RFKED
R28 = CRCW0402330RFKED: as R19 on sheet cc2538; Tolerance: 1%; Power: 1/16 W; package: 0402; Supplier 1: Digi-Key; Supplier Part Number 1: 541-330LCT-ND; value: 330; Manufacturer Part Number: CRCW0402330RFKED
R29 = CRCW0402200RFKED: as R20 on sheet cc2538; Tolerance: 1%; Power: 1/16 W; package: 0402; Supplier 1: Digi-Key; Supplier Part Number 1: 541-200LCT-ND; value: 200; Manufacturer Part Number: CRCW0402200RFKED
R30 R31 R33 R34 = CRCW040210K0FKED: as R13 on sheet cc2538; Tolerance: 1%; Power: 1/16 W; package: 0402; Supplier 1: Digi-Key; Supplier Part Number 1: 541-10.0KLCT-ND; value: 10k; Manufacturer Part Number: CRCW040210K0FKED
SW1 = KT11P4SA2M35LFG: Tactile Switch SPST-NO Side Actuated Surface Mount, Right Angl; Supplier 1: Digi-Key; Supplier Part Number 1: CKN1858CT-ND
U6-U8 = TXS0108E-Q1: TXS0108E-Q1 8-Bit Bi-directional, Level-Shifting, Voltage Translator  for Open-Drain and Push-Pull Applications; Supplier 1: Digi-Key; Supplier Part Number 1: 296-42401-1-ND
U9 = MAX13035E: 6-Channel High-Speed Logic-Level Translators; Supplier 1: Digi-Key; Supplier Part Number 1: MAX13035EETE+-ND

## Sheet edison_misc.SchDoc: Edison Gateway - Misc
size Letter; Author: Ye-Sheng Kuo; DocumentNumber: 5; Revision: 3; SheetNumber: 5; SheetTotal: 10
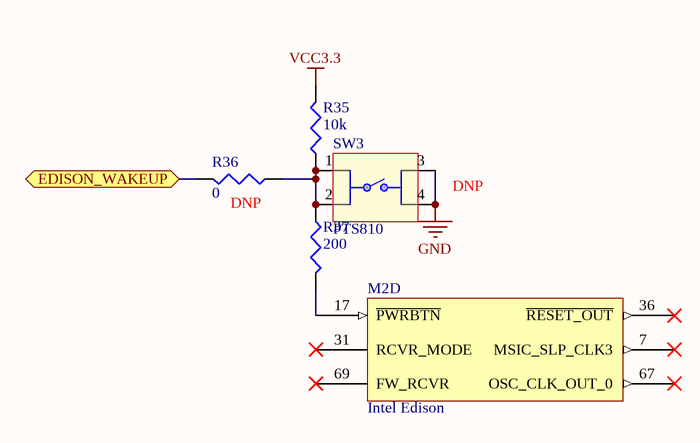
[diagram p3: edison_misc.SchDoc]

### Parts
M2  Intel Edison  [Intel Edison mating]  (part D of 5)
R35  10k  [0402]
R36  Note: DNP  [0402]  (hidden comment: 0)
R37  200  [0402]
SW3  PTS810  Note: DNP  [PTS810]

### Ports
EDISON_WAKEUP

### Nets
GND: SW3.3 SW3.4
VCC3.3: R35.1
NetM2_17: M2.17(~{PWRBTN}) R37.1
NetR35_2: R35.2 R36.2 R37.2 SW3.1 SW3.2
NetR36_1: R36.1 ; port EDISON_WAKEUP

Not connected (* = marked no-connect by the designer): M2 7(MSIC_SLP_CLK3)* 31(RCVR_MODE)* 36(~{RESET_OUT})* 67(OSC_CLK_OUT_0)* 69(FW_RCVR)*

### Notes on the sheet
- Title
- Date:
- Author:
- Revision:
- Sheet
- of
- University of Michigan
- File:

### Library data of the parts
M2 = Intel Edison: Note: Mating connector: H124603CT-ND
R35 = CRCW040210K0FKED: as R13 on sheet cc2538; Tolerance: 1%; Power: 1/16 W; package: 0402; Supplier 1: Digi-Key; Supplier Part Number 1: 541-10.0KLCT-ND; value: 10k; Manufacturer Part Number: CRCW040210K0FKED
R36 = CRCW04020000Z0EDHP: RES SMD 0.0 OHM JUMPER 1/5W 0402; Manufacturer: Vishay Dale; Temperature Coefficient: NA; package: 0402; Supplier 1: Digi-Key; Supplier Part Number 1: 541-0.0YBCT-ND; value: 0; Manufacturer Part Number: CRCW04020000Z0EDHP; Power: 1/5 W; Tolerance: NA
R37 = CRCW0402200RFKED: as R20 on sheet cc2538; Tolerance: 1%; Power: 1/16 W; package: 0402; Supplier 1: Digi-Key; Supplier Part Number 1: 541-200LCT-ND; value: 200; Manufacturer Part Number: CRCW0402200RFKED
SW3 = PTS810: Tactile Switches; Supplier 1: Digi-Key; Supplier Part Number 1: CKN10504CT-ND

## Sheet ethernet.SchDoc: Edison Gateway - Ethernet
size Letter; Author: Ye-Sheng Kuo; DocumentNumber: 6; Revision: 3; SheetNumber: 6; SheetTotal: 10
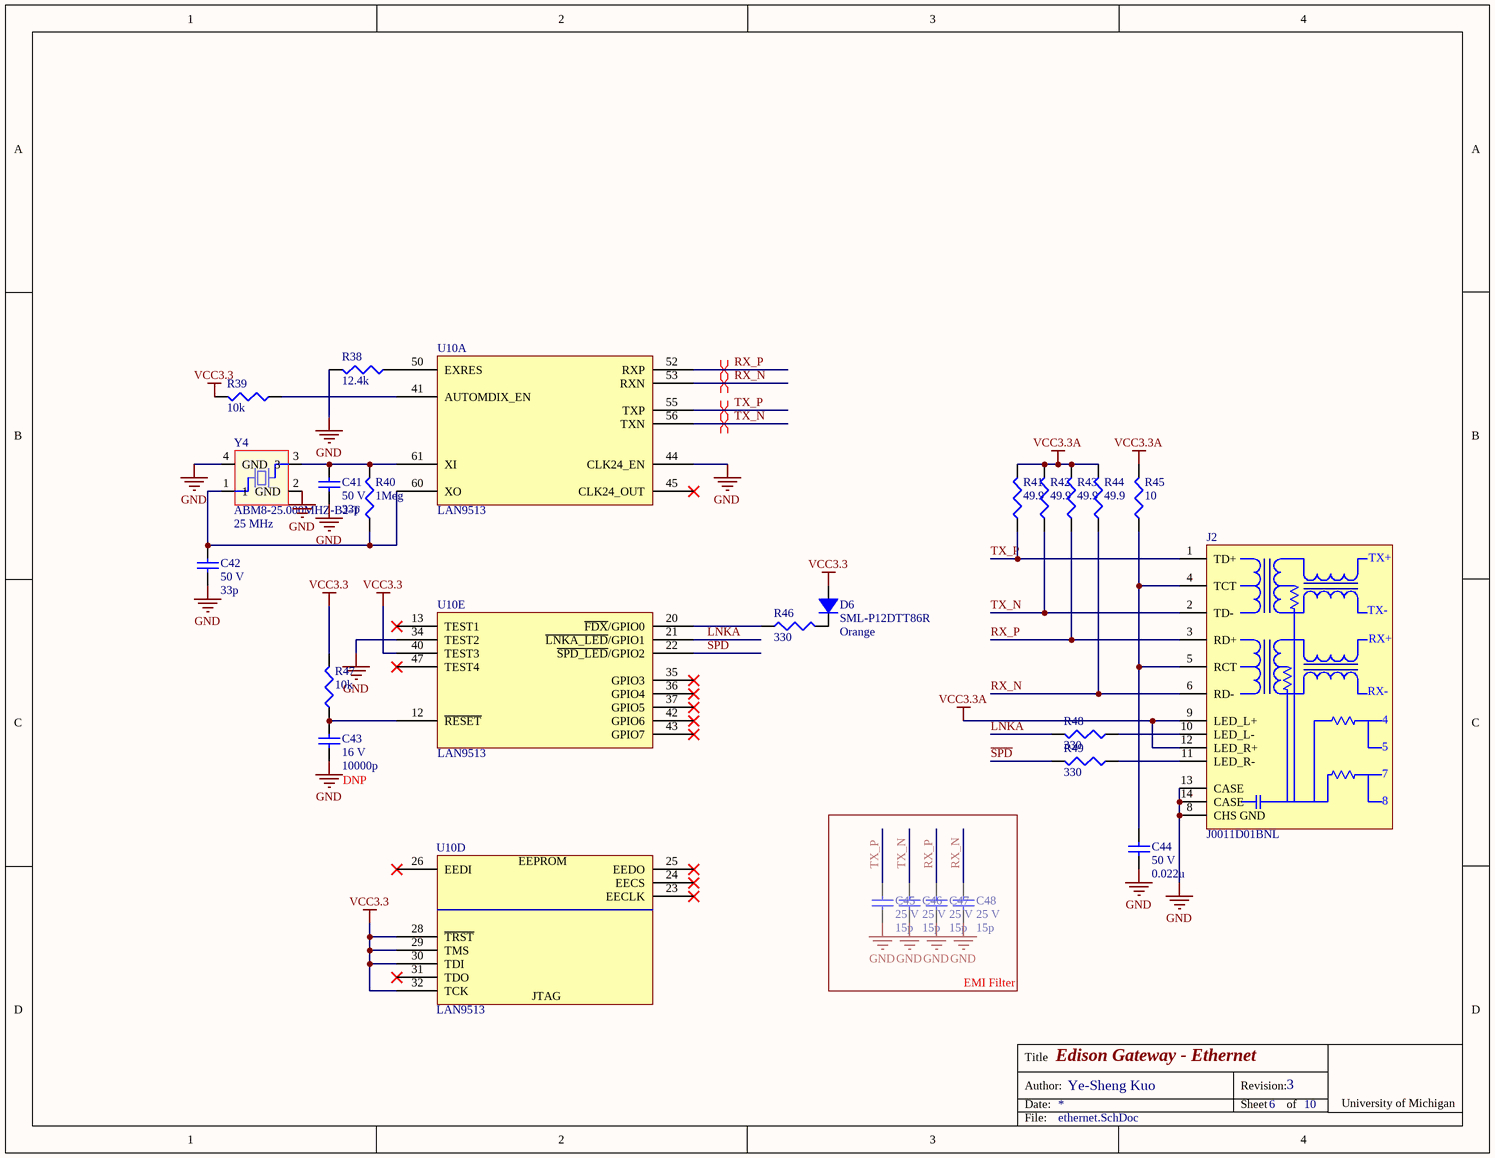
[diagram p4: ethernet.SchDoc]

### Parts
C41  voltage rated: 50 V  [0402]  (hidden comment: 33p)
C42  voltage rated: 50 V  [0402]  (hidden comment: 33p)
C43  voltage rated: 16 V  Note: DNP  [0402]  (hidden comment: 10000p)
C44  voltage rated: 50 V  [0402]  (hidden comment: 0.022u)
C45  voltage rated: 25 V  [0402]  (hidden comment: 15p)
C46  voltage rated: 25 V  [0402]  (hidden comment: 15p)
C47  voltage rated: 25 V  [0402]  (hidden comment: 15p)
C48  voltage rated: 25 V  [0402]  (hidden comment: 15p)
D6  SML-P12DTT86R  value Orange  [0402 - LED]
J2  J0011D01BNL  [J0011D01BNL]
R38  12.4k  [0402]
R39  10k  [0402]
R40  1Meg  [0402]
R41  49.9  [0402]
R42  49.9  [0402]
R43  49.9  [0402]
R44  49.9  [0402]
R45  10  [0402]
R46  330  [0402]
R47  10k  [0402]
R48  330  [0402]
R49  330  [0402]
U10  LAN9513  [QFN-64]  (parts A,D,E of 5)
Y4  ABM8-25.000MHZ-B2-T  Frequency: 25 MHz  [ABM8]

### Blocks framed on the sheet
EMI Filter: C45-C48

### Nets
GND: C41.2 C42.2 C43.2 C44.2 C45.2 C46.2 C47.2 C48.2 J2.8(CHS_GND) J2.13(CASE) J2.14(CASE) R38.1 U10.34(TEST2) U10.44(CLK24_EN) Y4.2(GND) Y4.4(GND)
VCC3.3: D6.1 R39.1 R47.1 U10.28(~{TRST}) U10.29(TMS) U10.30(TDI) U10.32(TCK) U10.40(TEST3)
VCC3.3A: J2.9(LED_L+) J2.12(LED_R+) R41.1 R42.1 R43.1 R44.1 R45.1
~{LNKA}: R48.1 U10.21(~{LNKA_LED}/GPIO1)
RX_N: C48.1 J2.6(RD-) R44.2 U10.53(RXN)
RX_P: C47.1 J2.3(RD+) R43.2 U10.52(RXP)
~{SPD}: R49.1 U10.22(~{SPD_LED}/GPIO2)
TX_N: C46.1 J2.2(TD-) R42.2 U10.56(TXN)
TX_P: C45.1 J2.1(TD+) R41.2 U10.55(TXP)
NetC41_1: C41.1 R40.1 U10.61(XI) Y4.3
NetC42_1: C42.1 R40.2 U10.60(XO) Y4.1
NetC43_1: C43.1 R47.2 U10.12(~{RESET})
NetC44_1: C44.1 J2.4(TCT) J2.5(RCT) R45.2
NetD6_2: D6.2 R46.1
NetJ2_10: J2.10(LED_L-) R48.2
NetJ2_11: J2.11(LED_R-) R49.2
NetR38_2: R38.2 U10.50(EXRES)
NetR39_2: R39.2 U10.41(AUTOMDIX_EN)
NetR46_2: R46.2 U10.20(~{FDX}/GPIO0)

Not connected (* = marked no-connect by the designer): U10 13(TEST1)* 23(EECLK)* 24(EECS)* 25(EEDO)* 26(EEDI)* 31(TDO)* 35(GPIO3)* 36(GPIO4)* 37(GPIO5)* 42(GPIO6)* 43(GPIO7)* 45(CLK24_OUT)* 47(TEST4)*

### Layout directives
differential pair: RX_N, RX_P, TX_N, TX_P

### Notes on the sheet
- Title
- Date:
- Author:
- Revision:
- Sheet
- of
- University of Michigan
- File:
- (in symbol J0011D01BNL) TX+; TX-; RX+; RX-; 7
- (in symbol LAN9513, part D) EEPROM; JTAG

### Library data of the parts
C41 C42 = GRM1555C1H330JA01D: 33pF ±5% 50V Ceramic Capacitor C0G, NP0 0402; Manufacture: Murata; tolerance: 5%; package: 0402; Supplier 1: Digi-Key; Supplier Part Number 1: 490-5936-1-ND; Value: 33p; Temperature Coefficient: C0G, NP0; Manufacturer Part Number: GRM1555C1H330JA01D
C43 = GRM155R71C103KA01D: 10000pF ±10% 16V Ceramic Capacitor X7R 0402; Manufacture: Murata; tolerance: 10%; package: 0402; Temperature Coefficient: X7R; Supplier 1: Digi-Key; Supplier Part Number 1: 490-1313-1-ND; Value: 10000p; Manufacturer Part Number: GRM155R71C103KA01D
C44 = GRM155R71H223KA12D: 0.022µF ±10% 50V Ceramic Capacitor X7R 0402; Manufacture: Murata; tolerance: 10%; package: 0402; Temperature Coefficient: X7R; Supplier 1: Digi-Key; Supplier Part Number 1: 490-3884-1-ND; Value: 0.022u; Manufacturer Part Number: GRM155R71H223KA12D
C45-C48 = GRM1555C1E150JA01D: 15pF ±5% 25V Ceramic Capacitor C0G, NP0 0402; Manufacture: Murata; tolerance: 5%; package: 0402; Supplier 1: Digi-Key; Supplier Part Number 1: 490-8171-1-ND; Value: 15p; Temperature Coefficient: C0G, NP0; Manufacturer Part Number: GRM1555C1E150JA01D
D6 = SML-P12DTT86R: as D4 on sheet cc2538; Supplier 1: Digi-Key; Supplier Part Number 1: 846-1200-1-ND; package: 0402; Forward Voltage: 2.1 V; Manufacturer Part Number: SML-P12DTT86R; Wavelength: 605 nm
J2 = J0011D01BNL: 1x1 Tab-Down RJ45; Supplier 1: Digi-Key; Supplier Part Number 1: 553-1483-ND
R38 = RC0402FR-0712K4L: RES SMD 12.4K OHM 1% 1/16W 0402; Manufacturer: Yageo; Temperature Coefficient: 100 ppm/C; Tolerance: 1%; Power: 1/16 W; package: 0402; Supplier 1: Digi-Key; Supplier Part Number 1: 311-12.4KLRCT-ND; value: 12.4k; Manufacturer Part Number: RC0402FR-0712K4L
R39 R47 = CRCW040210K0FKED: as R13 on sheet cc2538; Tolerance: 1%; Power: 1/16 W; package: 0402; Supplier 1: Digi-Key; Supplier Part Number 1: 541-10.0KLCT-ND; value: 10k; Manufacturer Part Number: CRCW040210K0FKED
R40 = CRCW04021M00FKED: RES SMD 1M OHM 1% 1/16W 0402; Manufacturer: Vishay Dale; Temperature Coefficient: 100 ppm/C; Tolerance: 1%; Power: 1/16 W; Supplier 1: Digi-Key; Supplier Part Number 1: 541-1.00MLCT-ND; package: 0402; value: 1Meg; Manufacturer Part Number: CRCW04021M00FKED
R41-R44 = CRCW040249R9FKED: RES SMD 49.9 OHM 1% 1/16W 0402; Manufacturer: Vishay Dale; Temperature Coefficient: 100 ppm/C; Tolerance: 1%; Power: 1/16 W; package: 0402; Supplier 1: Digi-Key; Supplier Part Number 1: 541-49.9LCT-ND; value: 49.9; Manufacturer Part Number: CRCW040249R9FKED
R45 = CRCW040210R0FKED: RES SMD 10 OHM 1% 1/16W 0402; Manufacturer: Vishay Dale; Temperature Coefficient: 100 ppm/C; Tolerance: 1%; Power: 1/16 W; package: 0402; Supplier 1: Digi-Key; Supplier Part Number 1: 541-10.0LCT-ND; value: 10; Manufacturer Part Number: CRCW040210R0FKED
R46 R48 R49 = CRCW0402330RFKED: as R19 on sheet cc2538; Tolerance: 1%; Power: 1/16 W; package: 0402; Supplier 1: Digi-Key; Supplier Part Number 1: 541-330LCT-ND; value: 330; Manufacturer Part Number: CRCW0402330RFKED
U10 = LAN9513: USB 2.0 Hub and 10/100  Ethernet Controller; Supplier 1: Digi-Key; Supplier Part Number 1: LAN9513-JZX-ND
Y4 = ABM8-25.000MHZ-B2-T: Crystal 25.0000MHz 20ppm 18pF 50 Ohm; Frequency stability: 50 ppm; ESR: 50 ohm; Load capacitance: 18 pF; Frequency tolerance: 20 ppm; Supplier 1: Digi-Key; Supplier Part Number 1: 535-9140-1-ND

## Sheet power.SchDoc: Edison Gateway - Power
size Letter; Author: Ye-Sheng Kuo; DocumentNumber: 2; Revision: 3; SheetNumber: 2; SheetTotal: 10
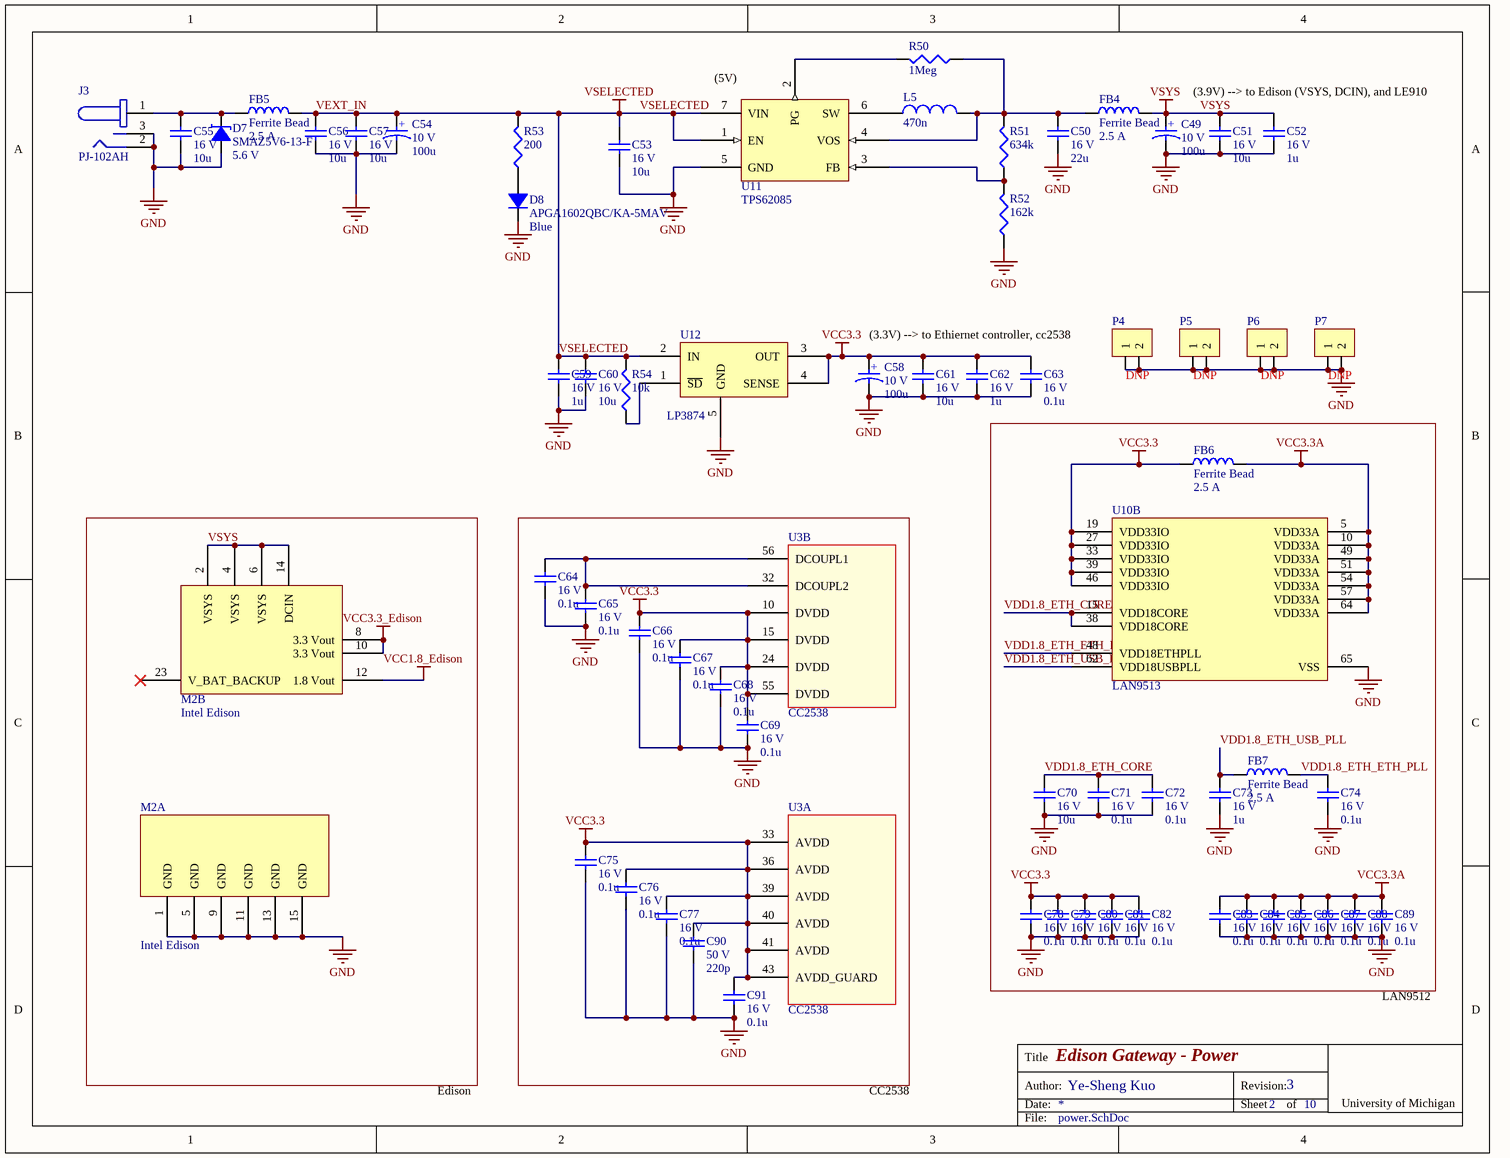
[diagram p5: power.SchDoc]

### Parts
C49  voltage rated: 10 V  [1206 - POLAR MARKING]  (hidden comment: 100u)
C50  voltage rated: 16 V  [1206]  (hidden comment: 22u)
C51  voltage rated: 16 V  [0603]  (hidden comment: 10u)
C52  voltage rated: 16 V  [0402]  (hidden comment: 1u)
C53  voltage rated: 16 V  [0603]  (hidden comment: 10u)
C54  voltage rated: 10 V  [1206 - POLAR MARKING]  (hidden comment: 100u)
C55  voltage rated: 16 V  [0603]  (hidden comment: 10u)
C56  voltage rated: 16 V  [0603]  (hidden comment: 10u)
C57  voltage rated: 16 V  [0603]  (hidden comment: 10u)
C58  voltage rated: 10 V  [1206 - POLAR MARKING]  (hidden comment: 100u)
C59  voltage rated: 16 V  [0402]  (hidden comment: 1u)
C60  voltage rated: 16 V  [0603]  (hidden comment: 10u)
C61  voltage rated: 16 V  [0603]  (hidden comment: 10u)
C62  voltage rated: 16 V  [0402]  (hidden comment: 1u)
C63  voltage rated: 16 V  [0402]  (hidden comment: 0.1u)
C64  voltage rated: 16 V  [0402]  (hidden comment: 0.1u)
C65  voltage rated: 16 V  [0402]  (hidden comment: 0.1u)
C66  voltage rated: 16 V  [0402]  (hidden comment: 0.1u)
C67  voltage rated: 16 V  [0402]  (hidden comment: 0.1u)
C68  voltage rated: 16 V  [0402]  (hidden comment: 0.1u)
C69  voltage rated: 16 V  [0402]  (hidden comment: 0.1u)
C70  voltage rated: 16 V  [0603]  (hidden comment: 10u)
C71  voltage rated: 16 V  [0402]  (hidden comment: 0.1u)
C72  voltage rated: 16 V  [0402]  (hidden comment: 0.1u)
C73  voltage rated: 16 V  [0402]  (hidden comment: 1u)
C74  voltage rated: 16 V  [0402]  (hidden comment: 0.1u)
C75  voltage rated: 16 V  [0402]  (hidden comment: 0.1u)
C76  voltage rated: 16 V  [0402]  (hidden comment: 0.1u)
C77  voltage rated: 16 V  [0402]  (hidden comment: 0.1u)
C78  voltage rated: 16 V  [0402]  (hidden comment: 0.1u)
C79  voltage rated: 16 V  [0402]  (hidden comment: 0.1u)
C80  voltage rated: 16 V  [0402]  (hidden comment: 0.1u)
C81  voltage rated: 16 V  [0402]  (hidden comment: 0.1u)
C82  voltage rated: 16 V  [0402]  (hidden comment: 0.1u)
C83  voltage rated: 16 V  [0402]  (hidden comment: 0.1u)
C84  voltage rated: 16 V  [0402]  (hidden comment: 0.1u)
C85  voltage rated: 16 V  [0402]  (hidden comment: 0.1u)
C86  voltage rated: 16 V  [0402]  (hidden comment: 0.1u)
C87  voltage rated: 16 V  [0402]  (hidden comment: 0.1u)
C88  voltage rated: 16 V  [0402]  (hidden comment: 0.1u)
C89  voltage rated: 16 V  [0402]  (hidden comment: 0.1u)
C90  voltage rated: 50 V  [0402]  (hidden comment: 220p)
C91  voltage rated: 16 V  [0402]  (hidden comment: 0.1u)
D7  SMAZ5V6-13-F  Zener Voltage: 5.6 V  [SMAZ5V1]
D8  APGA1602QBC/KA-5MAV  value Blue  [APGA1602]
FB4  Ferrite Bead  Current Rating (Max): 2.5 A  [0603]
FB5  Ferrite Bead  Current Rating (Max): 2.5 A  [0603]
FB6  Ferrite Bead  Current Rating (Max): 2.5 A  [0603]
FB7  Ferrite Bead  Current Rating (Max): 2.5 A  [0603]
J3  PJ-102AH  [PJ-102AH]
L5  470n  [74404300047]
M2  Intel Edison  [Intel Edison mating]  (parts A,B of 5)
P4  Note: DNP  [1x2 header]  (hidden comment: 1 x 2 header)
P5  Note: DNP  [1x2 header]  (hidden comment: 1 x 2 header)
P6  Note: DNP  [1x2 header]  (hidden comment: 1 x 2 header)
P7  Note: DNP  [1x2 header]  (hidden comment: 1 x 2 header)
R50  1Meg  [0402]
R51  634k  [0402]
R52  162k  [0402]
R53  200  [0402]
R54  10k  [0402]
U3  CC2538  [QFN56]  (parts A,B of 6)
U10  LAN9513  [QFN-64]  (part B of 5)
U11  TPS62085  [VSON]
U12  LP3874  [SOT150P700X180-5N]

### Nets
GND: C49.2 C50.2 C51.2 C52.2 C53.2 C54.2 C55.2 C56.2 C57.2 C58.2 C59.2 C60.2 C61.2 C62.2 C63.2 C64.2 C65.2 C66.2 C67.2 C68.2 C69.2 C70.2 C71.2 C72.2 C73.2 C74.2 C75.2 C76.2 C77.2 C78.2 C79.2 C80.2 C81.2 C82.2 C83.2 C84.2 C85.2 C86.2 C87.2 C88.2 C89.2 C90.2 C91.2 D7.1 D8.2 J3.2 J3.3 M2.1(GND) M2.5(GND) M2.9(GND) M2.11(GND) M2.13(GND) M2.15(GND) P4.1 P4.2 P5.1 P5.2 P6.1 P6.2 P7.1 P7.2 R52.2 U10.65(VSS) U11.5(GND) U12.5(GND)
VCC1.8_Edison: M2.12(1.8_Vout)
VCC3.3: C58.1 C61.1 C62.1 C63.1 C66.1 C67.1 C68.1 C69.1 C75.1 C76.1 C77.1 C78.1 C79.1 C80.1 C81.1 C82.1 C90.1 C91.1 FB6.2 U3.10(DVDD) U3.15(DVDD) U3.24(DVDD) U3.33(AVDD) U3.36(AVDD) U3.39(AVDD) U3.40(AVDD) U3.41(AVDD) U3.43(AVDD_GUARD) U3.55(DVDD) U10.19(VDD33IO) U10.27(VDD33IO) U10.33(VDD33IO) U10.39(VDD33IO) U10.46(VDD33IO) U12.3(OUT) U12.4(SENSE)
VCC3.3_Edison: M2.8(3.3_Vout) M2.10(3.3_Vout)
VCC3.3A: C83.1 C84.1 C85.1 C86.1 C87.1 C88.1 C89.1 FB6.1 U10.5(VDD33A) U10.10(VDD33A) U10.49(VDD33A) U10.51(VDD33A) U10.54(VDD33A) U10.57(VDD33A) U10.64(VDD33A)
VEXT_IN: C53.1 C54.1 C56.1 C57.1 C59.1 C60.1 FB5.1 R53.1 R54.1 U11.1(EN) U11.7(VIN) U12.2(IN)  [also labelled VSELECTED]
VSYS: C49.1 C51.1 C52.1 FB4.1 M2.2(VSYS) M2.4(VSYS) M2.6(VSYS) M2.14(DCIN)
VDD1.8_ETH_CORE: C70.1 C71.1 C72.1 U10.15(VDD18CORE) U10.38(VDD18CORE)
VDD1.8_ETH_ETH_PLL: C74.1 FB7.1 U10.48(VDD18ETHPLL)
VDD1.8_ETH_USB_PLL: C73.1 FB7.2 U10.62(VDD18USBPLL)
NetC50_1: C50.1 FB4.2 L5.1 R50.2 R51.1 U11.4(VOS)
NetC55_1: C55.1 D7.2 FB5.2 J3.1
NetC64_1: C64.1 C65.1 U3.32(DCOUPL2) U3.56(DCOUPL1)
NetD8_1: D8.1 R53.2
NetL5_2: L5.2 U11.6(SW)
NetR50_1: R50.1 U11.2(PG)
NetR51_2: R51.2 R52.1 U11.3(FB)
NetR54_2: R54.2 U12.1(~{SD})

Not connected (* = marked no-connect by the designer): M2 23(V_BAT_BACKUP)*

### Notes on the sheet
- (near U11) (5V)
- (3.9V) --> to Edison (VSYS, DCIN), and LE910
- (near P4) (3.3V) --> to Ethiernet controller, cc2538
- LAN9512
- Edison
- CC2538
- Title
- Date:
- Author:
- Revision:
- Sheet
- of
- University of Michigan
- File:
- (in symbol TLNK107M010R2500) +

### Library data of the parts
C49 C54 C58 = TLNK107M010R2500: 100µF ±20% Molded Tantalum Capacitors 10V 1206; Manufacture: AVX; ESR: 2.5 Ohm; tolerance: 20%; package: 1206; Supplier 1: Digi-Key; Supplier Part Number 1: 478-6251-1-ND; Value: 100u; Manufacturer Part Number: TLNK107M010R2500
C50 = CL31A226MOCLNNC: 22µF ±20% 16V Ceramic Capacitor X5R 1206; Manufacture: Samsung; tolerance: 20%; package: 1206; Supplier 1: Digi-Key; Supplier Part Number 1: 1276-2728-1-ND; Value: 22u; Temperature Coefficient: X5R; Manufacturer Part Number: CL31A226MOCLNNC
C51 C53 C55-C57 C60 C61 C70 = GRM188C81C106MA73D: as C25 on sheet cc2538; tolerance: 20%; package: 0603; Temperature Coefficient: X6S; Supplier 1: Digi-Key; Supplier Part Number 1: 490-7198-1-ND; Value: 10u; Manufacturer Part Number: GRM188C81C106MA73D
C52 C59 C62 C73 = C1005X6S1C105K050BC: as C40 on sheet edison_gpio; tolerance: 10%; package: 0402; Supplier 1: Digi-Key; Supplier Part Number 1: 445-9086-1-ND; Value: 1u; Temperature Coefficient: X6S; Manufacturer Part Number: C1005X6S1C105K050BC
C63-C69 C71 C72 C74-C89 C91 = GRM155R71C104KA88D: as C24 on sheet cc2538; tolerance: 10%; package: 0402; Supplier 1: Digi-Key; Supplier Part Number 1: 490-3261-1-ND; Value: 0.1u; Temperature Coefficient: X7R; Manufacturer Part Number: GRM155R71C104KA88D
C90 = C0402C221K5RACTU: 220pF ±10% 50V Ceramic Capacitor X7R 0402; Manufacture: Kemet; tolerance: 10%; package: 0402; Supplier 1: Digi-Key; Supplier Part Number 1: 399-1030-1-ND; Value: 220p; Temperature Coefficient: X7R; Manufacturer Part Number: C0402C221K5RACTU
D7 = SMAZ5V6-13-F: Zener Diode 5.6V 1W ±5% Surface Mount SMA; Manufacturer: Diodes Incorporated; reverse current: 5 uA @ 2 V; Manufacturer Part Number: SMAZ5V6-13-F; diode type: Zener; Supplier 1: Digi-Key; Supplier Part Number 1: SMAZ5V6-FDICT-ND; power: 1 W
D8 = APGA1602QBC/KA-5MAV: Blue 463nm LED Indication - Discrete 2.8V 2-SMD; Manufacturer: Kingbright; Current @ VF: 5 mA; Forward Voltage: 2.8 V; Manufacturer Part Number: APGA1602QBC/KA-5MAV; Wavelength: 463 nm; Supplier 1: Digi-Key; Supplier Part Number 1: 754-1821-1-ND
FB4-FB7 = BLM18SG221TN1D: as FB3 on sheet cc2538; package: 0603; Supplier 1: Digi-Key; Supplier Part Number 1: 490-5225-1-ND; Manufacturer Part Number: BLM18SG221TN1D
J3 = PJ-102AH: CONN PWR JACK 2.1X5.5MM HIGH CUR; Supplier 1: Digi-Key; Supplier Part Number 1: CP-102AH-ND
L5 = 74404300047: 470nH Shielded Wirewound Inductor 3.8A 16 mOhm Max 1919 (4848 Metric); Manufacturer: Wurth Electronics Inc; tolerance: 30%; DCR (Max): 16m; Supplier 1: Digi-Key; Supplier Part Number 1: 732-4087-1-ND; Value: 470n; Current Rating: 3.8 A; Manufacturer Part Number: 74404300047
M2 = Intel Edison: Note: Mating connector: H124603CT-ND
P4-P7 = 1 x 2 header: 100 mils standard header; Supplier 1: Digi-Key; Supplier Part Number 1: 3M9447-ND
R50 = CRCW04021M00FKED: as R40 on sheet ethernet; Tolerance: 1%; Power: 1/16 W; Supplier 1: Digi-Key; Supplier Part Number 1: 541-1.00MLCT-ND; package: 0402; value: 1Meg; Manufacturer Part Number: CRCW04021M00FKED
R51 = CRCW0402634KFKED: RES SMD 634K OHM 1% 1/16W 0402; Manufacturer: Vishay Dale; Temperature Coefficient: 100 ppm/C; Tolerance: 1%; Power: 1/16 W; package: 0402; Supplier 1: Digi-Key; Supplier Part Number 1: 541-634KLCT-ND; value: 634k; Manufacturer Part Number: CRCW0402634KFKED
R52 = CRCW0402162KFKED: RES SMD 162K OHM 1% 1/16W 0402; Manufacturer: Vishay Dale; Temperature Coefficient: 100 ppm/C; Tolerance: 1%; Power: 1/16 W; package: 0402; Supplier 1: Digi-Key; Supplier Part Number 1: 541-162KLCT-ND; value: 162k; Manufacturer Part Number: CRCW0402162KFKED
R53 = CRCW0402200RFKED: as R20 on sheet cc2538; Tolerance: 1%; Power: 1/16 W; package: 0402; Supplier 1: Digi-Key; Supplier Part Number 1: 541-200LCT-ND; value: 200; Manufacturer Part Number: CRCW0402200RFKED
R54 = CRCW040210K0FKED: as R13 on sheet cc2538; Tolerance: 1%; Power: 1/16 W; package: 0402; Supplier 1: Digi-Key; Supplier Part Number 1: 541-10.0KLCT-ND; value: 10k; Manufacturer Part Number: CRCW040210K0FKED
U3 = CC2538: as U3 on sheet cc2538; Supplier 1: Digi-Key; Supplier Part Number 1: 296-35797-1-ND
U10 = LAN9513: as U10 on sheet ethernet; Supplier 1: Digi-Key; Supplier Part Number 1: LAN9513-JZX-ND
U11 = TPS62085: 3-A Step-Down Converter With Hiccup Short-Circuit Protection  In 2 × 2 QFN Package; Supplier 1: Digi-Key; Supplier Part Number 1: 296-40830-1-ND
U12 = LP3874: LP387x 0.8-A Fast Ultra-Low-Dropout Linear Regulators; Supplier 1: Digi-Key; Supplier Part Number 1: LP3874EMP-3.3/NOPBCT-ND

## Sheet usb_host_slave.SchDoc: Edison Gateway - USB
size Letter; Author: Ye-Sheng Kuo; DocumentNumber: 4; Revision: 3; SheetNumber: 4; SheetTotal: 10
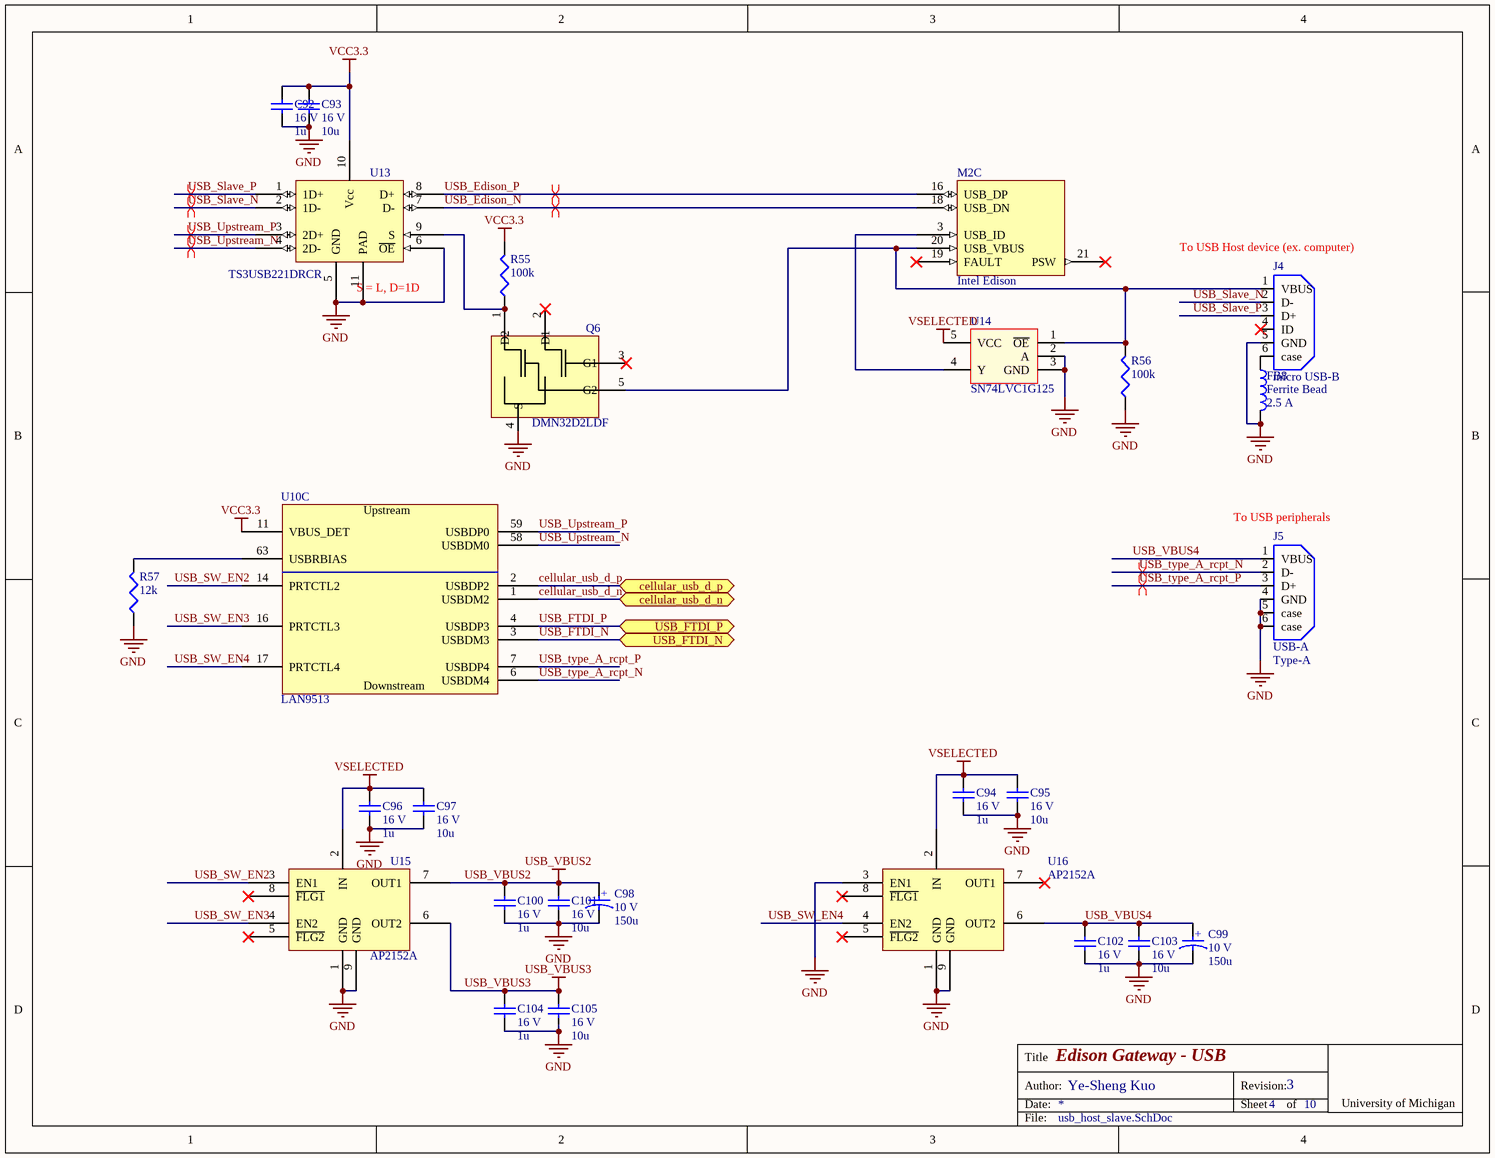
[diagram p6: usb_host_slave.SchDoc]

### Parts
C92  voltage rated: 16 V  [0402]  (hidden comment: 1u)
C93  voltage rated: 16 V  [0603]  (hidden comment: 10u)
C94  voltage rated: 16 V  [0402]  (hidden comment: 1u)
C95  voltage rated: 16 V  [0603]  (hidden comment: 10u)
C96  voltage rated: 16 V  [0402]  (hidden comment: 1u)
C97  voltage rated: 16 V  [0603]  (hidden comment: 10u)
C98  voltage rated: 10 V  [2312]  (hidden comment: 150u)
C99  voltage rated: 10 V  [2312]  (hidden comment: 150u)
C100  voltage rated: 16 V  [0402]  (hidden comment: 1u)
C101  voltage rated: 16 V  [0603]  (hidden comment: 10u)
C102  voltage rated: 16 V  [0402]  (hidden comment: 1u)
C103  voltage rated: 16 V  [0603]  (hidden comment: 10u)
C104  voltage rated: 16 V  [0402]  (hidden comment: 1u)
C105  voltage rated: 16 V  [0603]  (hidden comment: 10u)
FB8  Ferrite Bead  Current Rating (Max): 2.5 A  [0603]
J4  micro USB-B  [Micro USB-B]
J5  USB-A  Type: Type-A  [292303-2]
M2  Intel Edison  [Intel Edison mating]  (part C of 5)
Q6  DMN32D2LDF  [SOT-353-5]
R55  100k  [0402]
R56  100k  [0402]
R57  12k  [0402]
U10  LAN9513  [QFN-64]  (part C of 5)
U13  TS3USB221DRCR  [S-PVSON-N10]
U14  SN74LVC1G125  [SOT23-5]
U15  AP2152A  [U-DFN3030-8]
U16  AP2152A  [U-DFN3030-8]

### Ports
cellular_usb_d_n, cellular_usb_d_p, USB_FTDI_N, USB_FTDI_P

### Nets
GND: C92.2 C93.2 C94.2 C95.2 C96.2 C97.2 C98.2 C99.2 C100.2 C101.2 C102.2 C103.2 C104.2 C105.2 FB8.1 J4.5(GND) J5.4(GND) J5.5(case) J5.6(case) Q6.4(S) R56.2 R57.2 U13.5(GND) U13.6(~{OE}) U13.11(PAD) U14.2(A) U14.3(GND) U15.1(GND) U15.9(GND) U16.1(GND) U16.3(EN1) U16.9(GND)
USB_VBUS2: C98.1 C100.1 C101.1 U15.7(OUT1)
USB_VBUS3: C104.1 C105.1 U15.6(OUT2)
VCC3.3: C92.1 C93.1 R55.1 U10.11(VBUS_DET) U13.10(Vcc)
VSELECTED: C94.1 C95.1 C96.1 C97.1 U14.5(VCC) U15.2(IN) U16.2(IN)  [project net VEXT_IN]
cellular_usb_d_n: U10.1(USBDM2) ; port cellular_usb_d_n
cellular_usb_d_p: U10.2(USBDP2) ; port cellular_usb_d_p
USB_Edison_N: M2.18(USB_DN) U13.7(D-)
USB_Edison_P: M2.16(USB_DP) U13.8(D+)
USB_FTDI_N: U10.3(USBDM3) ; port USB_FTDI_N
USB_FTDI_P: U10.4(USBDP3) ; port USB_FTDI_P
USB_Slave_N: J4.2(D-) U13.2(1D-)
USB_Slave_P: J4.3(D+) U13.1(1D+)
USB_SW_EN2: U10.14(PRTCTL2) U15.3(EN1)
USB_SW_EN3: U10.16(PRTCTL3) U15.4(EN2)
USB_SW_EN4: U10.17(PRTCTL4) U16.4(EN2)
USB_type_A_rcpt_N: J5.2(D-) U10.6(USBDM4)
USB_type_A_rcpt_P: J5.3(D+) U10.7(USBDP4)
USB_Upstream_N: U10.58(USBDM0) U13.4(2D-)
USB_Upstream_P: U10.59(USBDP0) U13.3(2D+)
USB_VBUS4: C99.1 C102.1 C103.1 J5.1(VBUS) U16.6(OUT2)
NetFB8_2: FB8.2 J4.6(case)
NetJ4_1: J4.1(VBUS) M2.20(USB_VBUS) Q6.5(G2) R56.1 U14.1(~{OE})
NetM2_3: M2.3(USB_ID) U14.4(Y)
NetQ6_1: Q6.1(D2) R55.2 U13.9(S)
NetR57_1: R57.1 U10.63(USBRBIAS)

Not connected (* = marked no-connect by the designer): J4 4(ID)*; M2 19(FAULT)* 21(PSW)*; Q6 2(D1)* 3(G1)*; U15 5(~{FLG2})* 8(~{FLG1})*; U16 5(~{FLG2})* 7(OUT1)* 8(~{FLG1})*

### Layout directives
differential pair: USB_Edison_N, USB_Edison_P, USB_Slave_N, USB_Slave_P, USB_type_A_rcpt_N, USB_type_A_rcpt_P, USB_Upstream_N, USB_Upstream_P

### Notes on the sheet
- (near U13) S = L, D=1D
- (near J4) To USB Host device (ex. computer)
- (near J5) To USB peripherals
- Title
- Date:
- Author:
- Revision:
- Sheet
- of
- University of Michigan
- File:
- (in symbol LAN9513, part C) Upstream; Downstream
- (in symbol TAJC157K010RNJ) +

### Library data of the parts
C92 C94 C96 C100 C102 C104 = C1005X6S1C105K050BC: as C40 on sheet edison_gpio; tolerance: 10%; package: 0402; Supplier 1: Digi-Key; Supplier Part Number 1: 445-9086-1-ND; Value: 1u; Temperature Coefficient: X6S; Manufacturer Part Number: C1005X6S1C105K050BC
C93 C95 C97 C101 C103 C105 = GRM188C81C106MA73D: as C25 on sheet cc2538; tolerance: 20%; package: 0603; Temperature Coefficient: X6S; Supplier 1: Digi-Key; Supplier Part Number 1: 490-7198-1-ND; Value: 10u; Manufacturer Part Number: GRM188C81C106MA73D
C98 C99 = TAJC157K010RNJ: 150µF ±10% Molded Tantalum Capacitors 10V 2312; Manufacture: AVX; ESR: 900m Ohm; tolerance: 10%; package: 2312; Supplier 1: Digi-Key; Supplier Part Number 1: 478-2352-1-ND; Value: 150u; Manufacturer Part Number: TAJC157K010RNJ
FB8 = BLM18SG221TN1D: as FB3 on sheet cc2538; package: 0603; Supplier 1: Digi-Key; Supplier Part Number 1: 490-5225-1-ND; Manufacturer Part Number: BLM18SG221TN1D
J4 = Micro USB: CONN USB MICRO B RECPT SMT R/A; Supplier 1: Digi-Key; Supplier Part Number 1: 609-4616-1-ND
J5 = A105221-ND: USB 2.0 Type A; Supplier 1: Digi-Key; Supplier Part Number 1: A105221-ND
M2 = Intel Edison: Note: Mating connector: H124603CT-ND
Q6 = DMN32D2LDF: Common Source Dual N-Channel MOSFET; Supplier 1: Digi-Key; Supplier Part Number 1: DMN32D2LDF-7DICT-ND
R55 R56 = CRCW0402100KFKED: as R14 on sheet cc2538; Tolerance: 1%; Power: 1/16 W; Supplier 1: Digi-Key; Supplier Part Number 1: 541-100KLCT-ND; package: 0402; value: 100k; Manufacturer Part Number: CRCW0402100KFKED
R57 = CRCW040212K0FKED: RES SMD 12K OHM 1% 1/16W 0402; Manufacturer: Vishay Dale; Temperature Coefficient: 100 ppm/C; Tolerance: 1%; Power: 1/16 W; package: 0402; Supplier 1: Digi-Key; Supplier Part Number 1: 541-12.0KLCT-ND; value: 12k; Manufacturer Part Number: CRCW040212K0FKED
U10 = LAN9513: as U10 on sheet ethernet; Supplier 1: Digi-Key; Supplier Part Number 1: LAN9513-JZX-ND
U13 = TS3USB221DRCR: High-Speed USB 2.0 (480-Mbps) 1:2 Multiplexer – Demultiplexer  Switch With Single Enable; Supplier 1: Digi-Key; Supplier Part Number 1: 296-21360-6-ND
U14 = SN74LVC1G125: as U4 on sheet cc2538; Supplier 1: Digi-Key; Supplier Part Number 1: 296-11603-1-ND
U15 U16 = AP2152A: 0.5A DUAL CHANNEL CURRENT-LIMITED  POWER SWITCH WITH OUTPUT DISCHARGE; Supplier 1: Digi-Key; Supplier Part Number 1: AP2152AFGEG-7DICT-ND